# EAGLE schematic CFT-PB1-revF-TSSOP (EAGLE 5.11)
DRAWN_BY: Alexios; PROJECT_NAME: CFT Mini-Computer; REVISION: Rev K; SHEET_DESCRIPTION: Bus Connectors; SIMULATION_FILENAME: N/A; URL: http://www.bedroomlan.org/cft

## Sheet 1 of 9
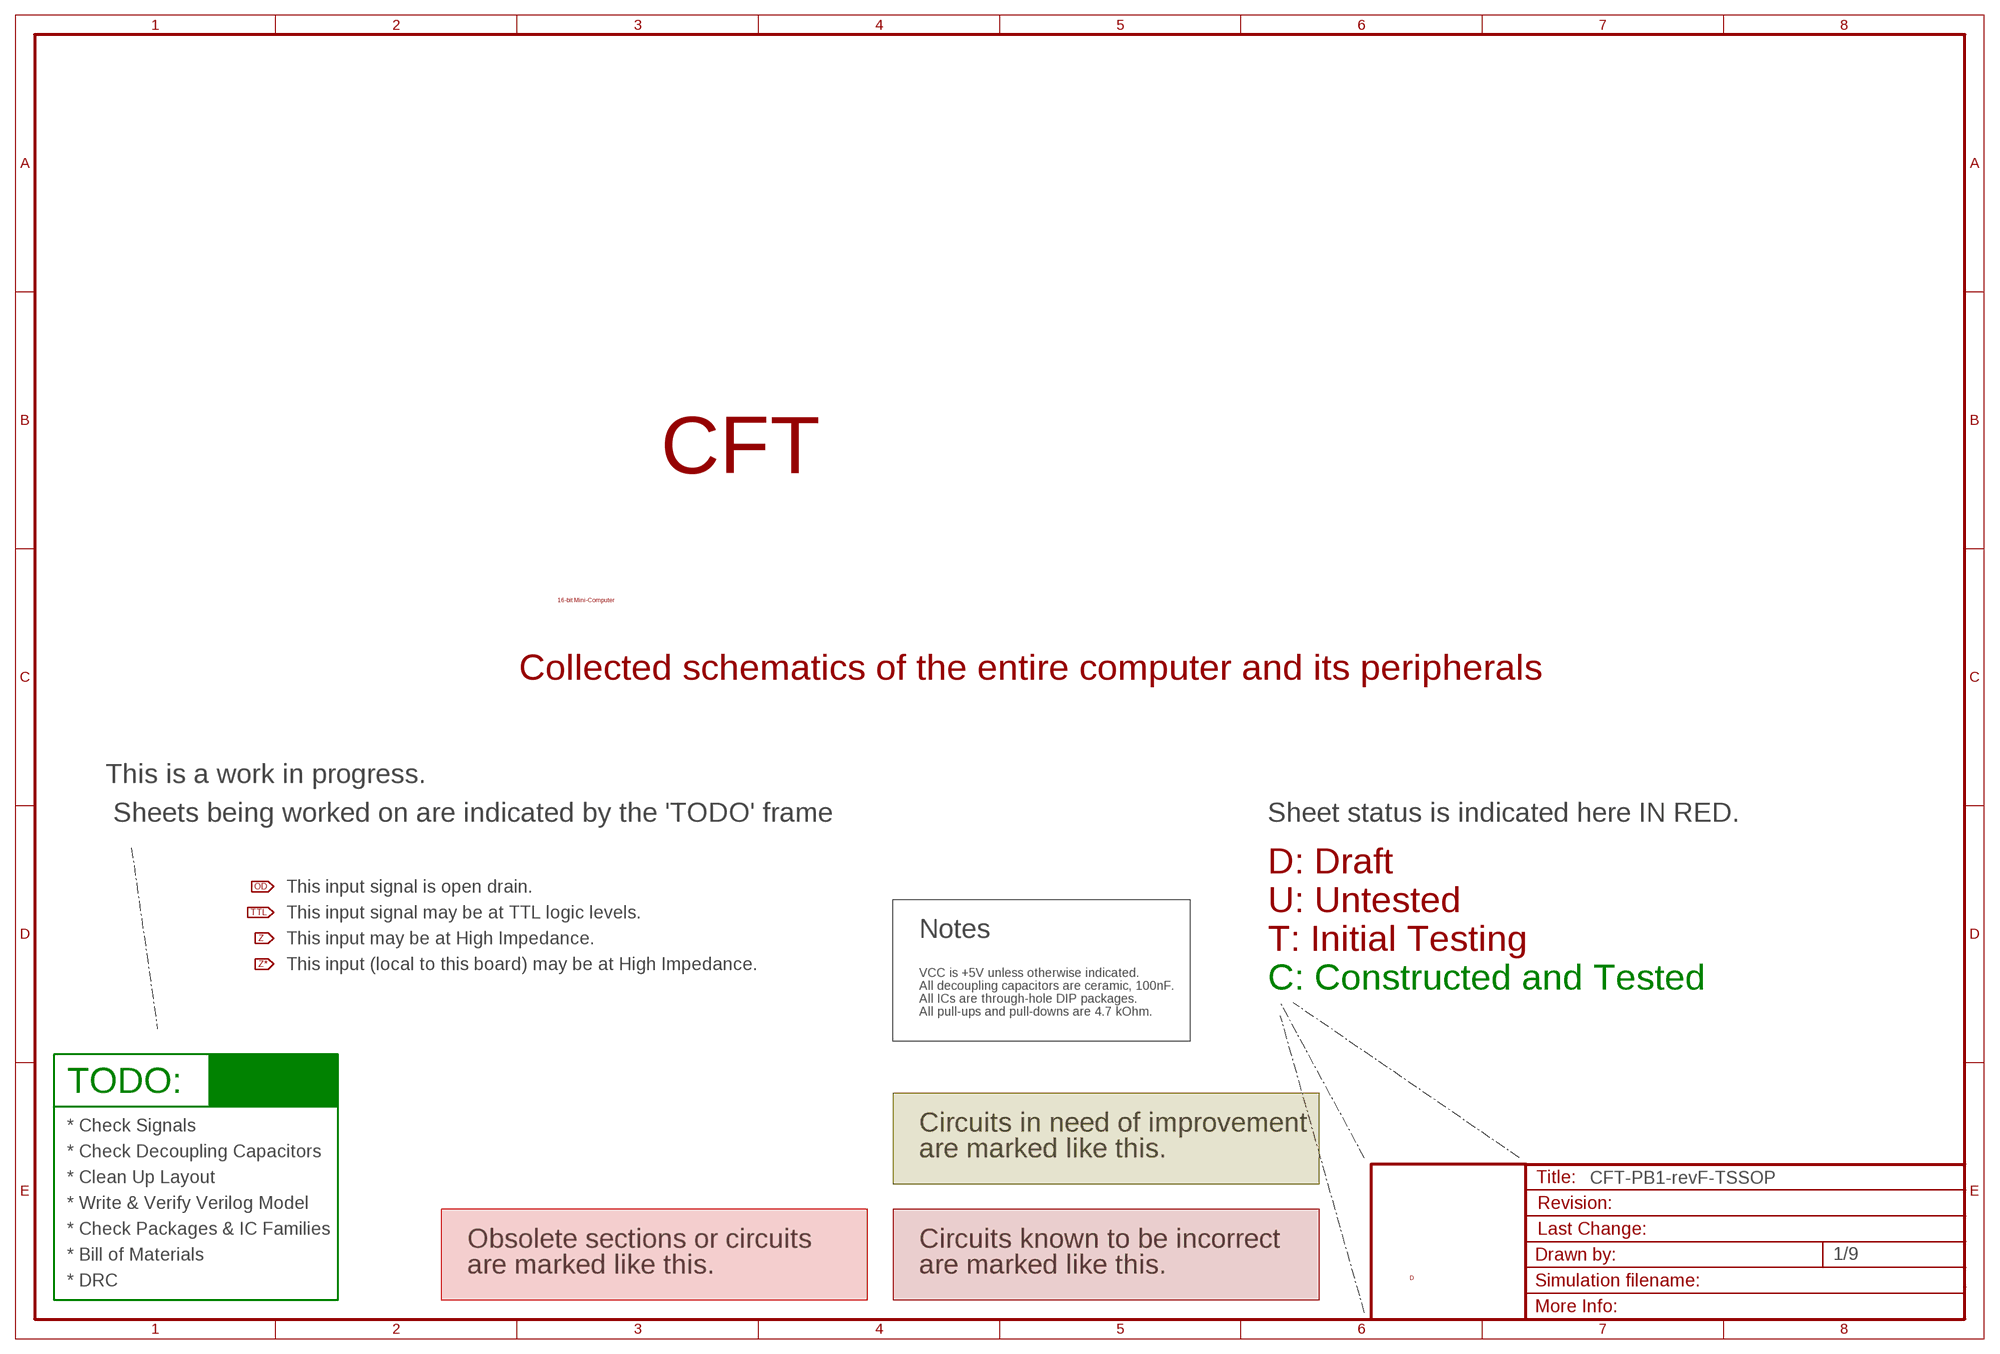
[diagram p0: schematic, sheet 1]

### Notes on the sheet
- CFT
- 16-bit Mini-Computer
- Collected schematics of the entire computer and its peripherals
- This is a work in progress.
- Sheets being worked on are indicated by the 'TODO' frame | Sheet status is indicated here IN RED.
- D: Draft
- This input signal is open drain.
- U: Untested
- This input signal may be at TTL logic levels.
- Notes
- This input may be at High Impedance.
- T: Initial Testing
- This input (local to this board) may be at High Impedance.
- VCC is +5V unless otherwise indicated.
- All decoupling capacitors are ceramic, 100nF. | C: Constructed and Tested
- All ICs are through-hole DIP packages.
- All pull-ups and pull-downs are 4.7 kOhm.
- TODO:
- * Check Signals | Circuits in need of improvement
- * Check Decoupling Capacitors | are marked like this.
- * Clean Up Layout
- * Write & Verify Verilog Model
- * Check Packages & IC Families
- Obsolete sections or circuits | Circuits known to be incorrect
- * Bill of Materials
- are marked like this. | are marked like this.
- D
- * DRC

## Sheet 2 of 9
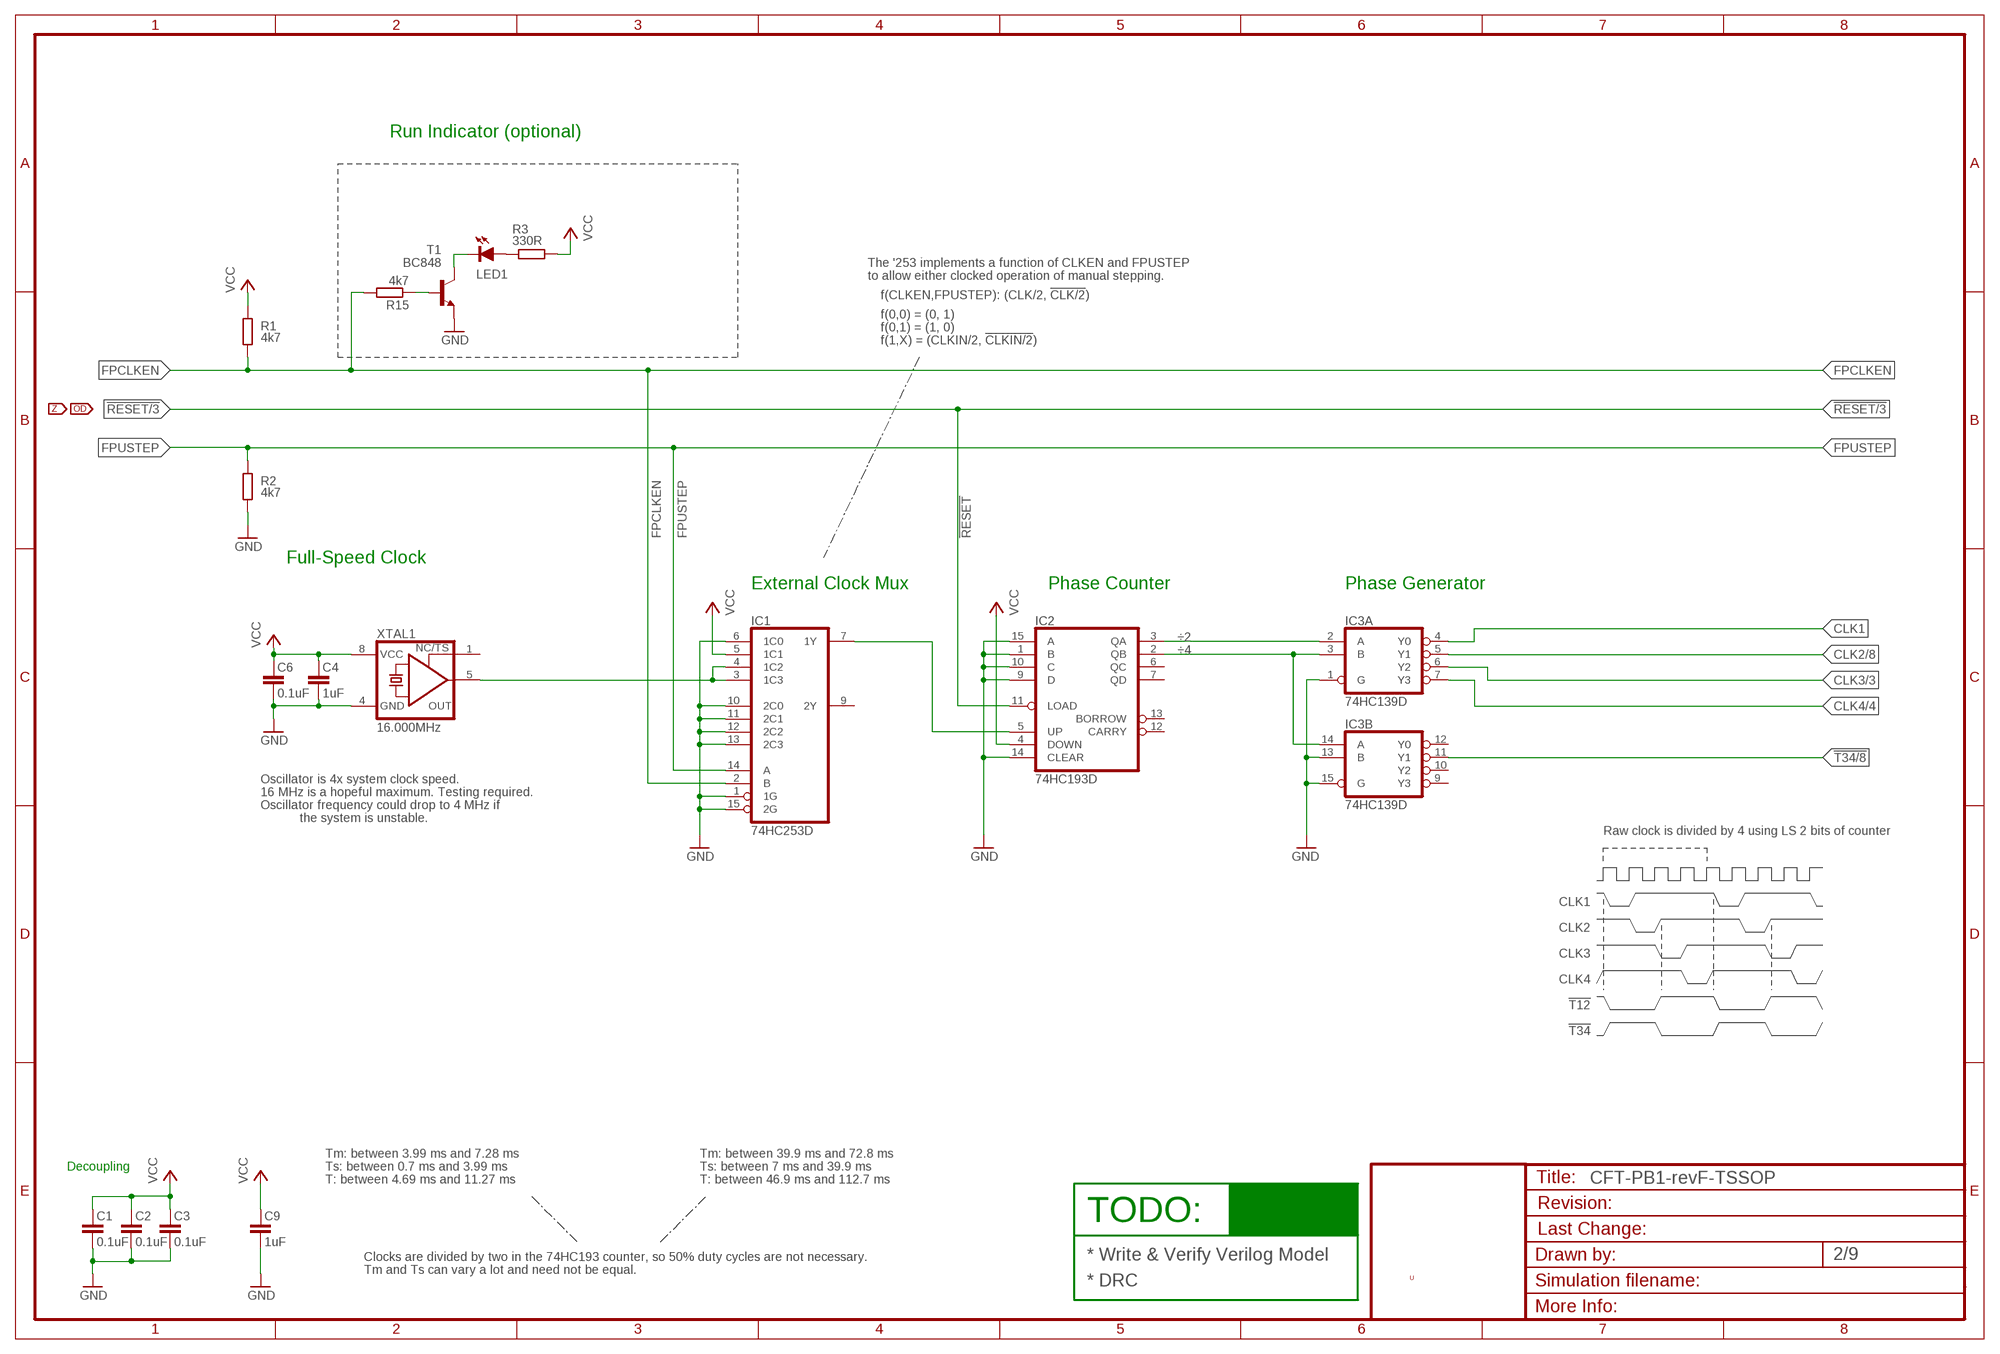
[diagram p1: schematic, sheet 2]

### Parts
C1  0.1uF  C-EUC0805K  [C0805K]
C2  0.1uF  C-EUC0805K  [C0805K]
C3  0.1uF  C-EUC0805K  [C0805K]
C4  1uF  C-EUC0805K  [C0805K]
C6  0.1uF  C-EUC0805K  [C0805K]
C9  1uF  C-EUC0805K  [C0805K]
IC1  74HC253D  [SO16]
IC2  74HC193D  [SO16D]
IC3  74HC139D  [SO16]
LED1  LED-5MM-GREEN  LEDCHIPLED_0805  [CHIPLED_0805]
R1  4k7  R-EU_R0805  [R0805]
R2  4k7  R-EU_R0805  [R0805]
R3  330R  R-EU_R0805  [R0805]
R15  4k7  R-EU_R0805  [R0805]
T1  BC848  [SOT23]
XTAL1  16.000MHz  XO-08-SOCKET  [DIL08S-SOCKET]

### Nets
!RESET: IC2.11(LOAD) ; also sheet 3,4,7,8,9
!T34: IC3.11(B:Y1) ; also sheet 8,9
CLK1: IC3.4(A:Y0) ; also sheet 9
CLK2: IC3.5(A:Y1) ; also sheet 8,9
CLK3: IC3.6(A:Y2) ; also sheet 3,9
CLK4: IC3.7(A:Y3) ; also sheet 4,8,9
CLKIN: IC1.7(1Y) IC2.5(UP)
FASTCLK: IC1.3(1C3) IC1.4(1C2) XTAL1.5(OUT)
FPCLKEN: IC1.2(B) R1.1 R15.2 ; also sheet 9
FPUSTEP: IC1.14(A) R2.2 ; also sheet 9
GND [Power rails]: C1.1 C2.1 C3.1 C4.1 C6.1 C9.1 IC1.1(1G) IC1.6(1C0) IC1.10(2C0) IC1.11(2C1) IC1.12(2C2) IC1.13(2C3) IC1.15(2G) IC2.1(B) IC2.9(D) IC2.10(C) IC2.14(CLEAR) IC2.15(A) IC3.1(A:G) IC3.13(B:B) IC3.15(B:G) R2.1 T1.2(E) XTAL1.4(GND) ; also sheet 3,4,5,6,7,8,9
N$8: R15.1 T1.1(B)
N$9: LED1.C T1.3(C)
N$10: LED1.A R3.2
VCC [Power rails]: C1.2 C2.2 C3.2 C4.2 C6.2 C9.2 IC1.5(1C1) IC2.4(DOWN) R1.2 R3.1 XTAL1.8(VCC) ; also sheet 3,4,5,6,7,8,9
÷2: IC2.3(QA) IC3.2(A:A)
÷4: IC2.2(QB) IC3.3(A:B) IC3.14(B:A)
Unconnected: IC1.9(2Y) IC2.6(QC) IC2.7(QD) IC2.12(CARRY) IC2.13(BORROW) IC3.9(B:Y3) IC3.10(B:Y2) IC3.12(B:Y0) XTAL1.1(TS)

### Notes on the sheet
- Run Indicator (optional)
- The '253 implements a function of CLKEN and FPUSTEP
- to allow either clocked operation of manual stepping.
- f(CLKEN,FPUSTEP): (CLK/2, !CLK/2!)
- f(0,0) = (0, 1)
- f(0,1) = (1, 0)
- f(1,X) = (CLKIN/2, !CLKIN/2!)
- Full-Speed Clock
- External Clock Mux | Phase Counter | Phase Generator
- Oscillator is 4x system clock speed.
- 16 MHz is a hopeful maximum. Testing required.
- Oscillator frequency could drop to 4 MHz if
- the system is unstable.
- Raw clock is divided by 4 using LS 2 bits of counter
- CLK1
- CLK2
- CLK3
- CLK4
- !T12
- !T34
- Tm: between 3.99 ms and 7.28 ms | Tm: between 39.9 ms and 72.8 ms
- Decoupling | Ts: between 0.7 ms and 3.99 ms | Ts: between 7 ms and 39.9 ms
- T: between 4.69 ms and 11.27 ms | T: between 46.9 ms and 112.7 ms
- TODO:
- Clocks are divided by two in the 74HC193 counter, so 50% duty cycles are not necessary. | * Write & Verify Verilog Model
- Tm and Ts can vary a lot and need not be equal.
- U
- * DRC

## Sheet 3 of 9
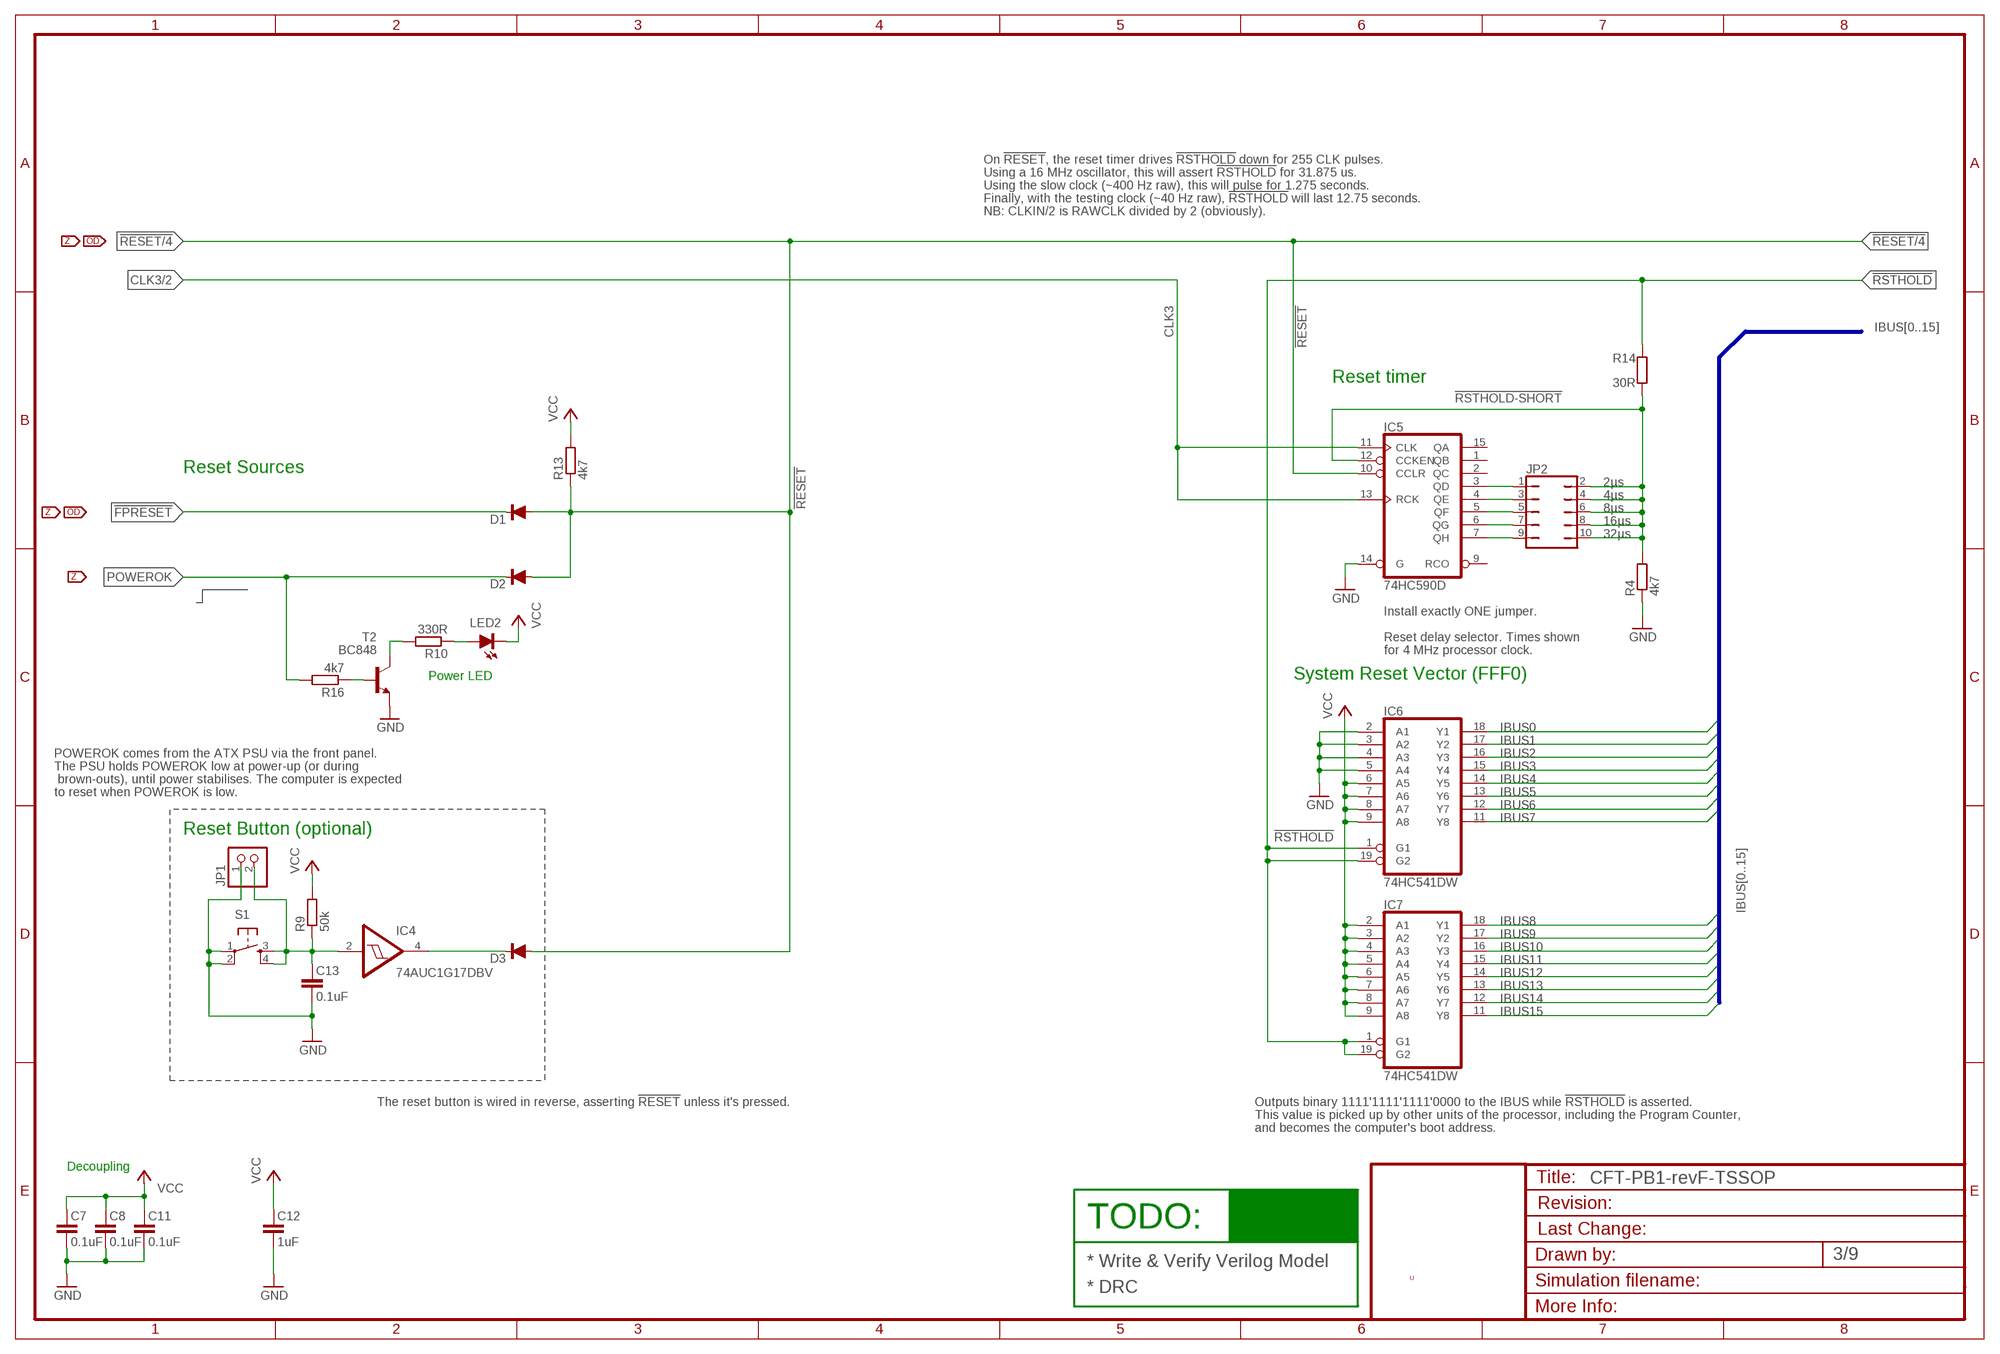
[diagram p2: schematic, sheet 3]

### Parts
C7  0.1uF  C-EUC0805K  [C0805K]
C8  0.1uF  C-EUC0805K  [C0805K]
C11  0.1uF  C-EUC0805K  [C0805K]
C12  1uF  C-EUC0805K  [C0805K]
C13  0.1uF  C-EUC0805K  [C0805K]
D1  DIODE-SOD123  [SOD123]
D2  DIODE-SOD123  [SOD123]
D3  DIODE-SOD123  [SOD123]
IC4  74AUC1G17DBV  [SOT23-5]
IC5  74HC590D  [SO16]
IC6  74HC541DW  [SO20W]
IC7  74HC541DW  [SO20W]
JP1  PINHD-1X2  [1X02]
JP2  JP5Q  [JP5Q]
LED2  LED-5MM-GREEN  LEDCHIPLED_0805  [CHIPLED_0805]
R4  4k7  R-EU_R0805  [R0805]
R9  50k  R-EU_R0805  [R0805]
R10  330R  R-EU_R0805  [R0805]
R13  4k7  R-EU_R0805  [R0805]
R14  30R  R-EU_R0805  [R0805]
R16  4k7  R-EU_R0805  [R0805]
S1  TAC_SWITCHPTH  [TACTILE-PTH]
T2  BC848  [SOT23]

### Nets
!FPRESET: D1.C ; also sheet 9
!RESET: D1.A D2.A D3.A IC5.10(CCLR) R13.1 ; also sheet 2,4,7,8,9
!RSTHOLD: IC6.1(G1) IC6.19(G2) IC7.1(G1) IC7.19(G2) R14.1 ; also sheet 9
!RSTHOLD-SHORT: IC5.12(CCKEN) JP2.2 JP2.4 JP2.6 JP2.8 JP2.10 R4.2 R14.2
CLK3: IC5.11(CLK) IC5.13(RCK) ; also sheet 2,9
GND [Power rails]: C7.1 C8.1 C11.1 C12.1 C13.1 IC5.14(G) IC6.2(A1) IC6.3(A2) IC6.4(A3) IC6.5(A4) JP1.1 R4.1 S1.1 S1.2 T2.2(E) ; also sheet 2,4,5,6,7,8,9
IBUS0: IC6.18(Y1) ; also sheet 5,6,8,9
IBUS1: IC6.17(Y2) ; also sheet 5,6,8,9
IBUS2: IC6.16(Y3) ; also sheet 5,6,8,9
IBUS3: IC6.15(Y4) ; also sheet 5,6,8,9
IBUS4: IC6.14(Y5) ; also sheet 5,6,8,9
IBUS5: IC6.13(Y6) ; also sheet 5,6,8,9
IBUS6: IC6.12(Y7) ; also sheet 5,6,8,9
IBUS7: IC6.11(Y8) ; also sheet 5,6,8,9
IBUS8: IC7.18(Y1) ; also sheet 5,6,8,9
IBUS9: IC7.17(Y2) ; also sheet 5,6,8,9
IBUS10: IC7.16(Y3) ; also sheet 5,6,8,9
IBUS11: IC7.15(Y4) ; also sheet 5,6,8,9
IBUS12: IC7.14(Y5) ; also sheet 5,6,8,9
IBUS13: IC7.13(Y6) ; also sheet 5,6,8,9
IBUS14: IC7.12(Y7) ; also sheet 5,6,8,9
IBUS15: IC7.11(Y8) ; also sheet 5,6,8,9
N$2: D3.C IC4.4(O)
N$11: R16.1 T2.1(B)
N$12: R10.2 T2.3(C)
N$33: C13.2 IC4.2(I) JP1.2 R9.1 S1.3 S1.4
N$36: IC5.7(QH) JP2.9
N$154: IC5.6(QG) JP2.7
N$375: IC5.5(QF) JP2.5
N$376: IC5.4(QE) JP2.3
N$377: IC5.3(QD) JP2.1
POWERLED: LED2.A R10.1
POWEROK: D2.C R16.2 ; also sheet 9
VCC [Power rails]: C7.2 C8.2 C11.2 C12.2 IC6.6(A5) IC6.7(A6) IC6.8(A7) IC6.9(A8) IC7.2(A1) IC7.3(A2) IC7.4(A3) IC7.5(A4) IC7.6(A5) IC7.7(A6) IC7.8(A7) IC7.9(A8) LED2.C R9.2 R13.2 ; also sheet 2,4,5,6,7,8,9
Unconnected: IC5.1(QB) IC5.2(QC) IC5.9(RCO) IC5.15(QA)

### Buses
IBUS[0..15]

### Notes on the sheet
- On !RESET!, the reset timer drives !RSTHOLD! down for 255 CLK pulses.
- Using a 16 MHz oscillator, this will assert !RSTHOLD! for 31.875 us.
- Using the slow clock (~400 Hz raw), this will pulse for 1.275 seconds.
- Finally, with the testing clock (~40 Hz raw), !RSTHOLD! will last 12.75 seconds.
- NB: CLKIN/2 is RAWCLK divided by 2 (obviously).
- Reset timer
- Reset Sources
- 2µs
- 4µs
- 8µs
- 16µs
- 32µs
- Install exactly ONE jumper.
- Reset delay selector. Times shown
- for 4 MHz processor clock.
- Power LED | System Reset Vector (FFF0)
- POWEROK comes from the ATX PSU via the front panel.
- The PSU holds POWEROK low at power-up (or during
- brown-outs), until power stabilises. The computer is expected
- to reset when POWEROK is low.
- Reset Button (optional)
- The reset button is wired in reverse, asserting !RESET! unless it's pressed. | Outputs binary 1111'1111'1111'0000 to the IBUS while !RSTHOLD! is asserted.
- This value is picked up by other units of the processor, including the Program Counter,
- and becomes the computer's boot address.
- Decoupling
- TODO:
- * Write & Verify Verilog Model
- U
- * DRC

## Sheet 4 of 9
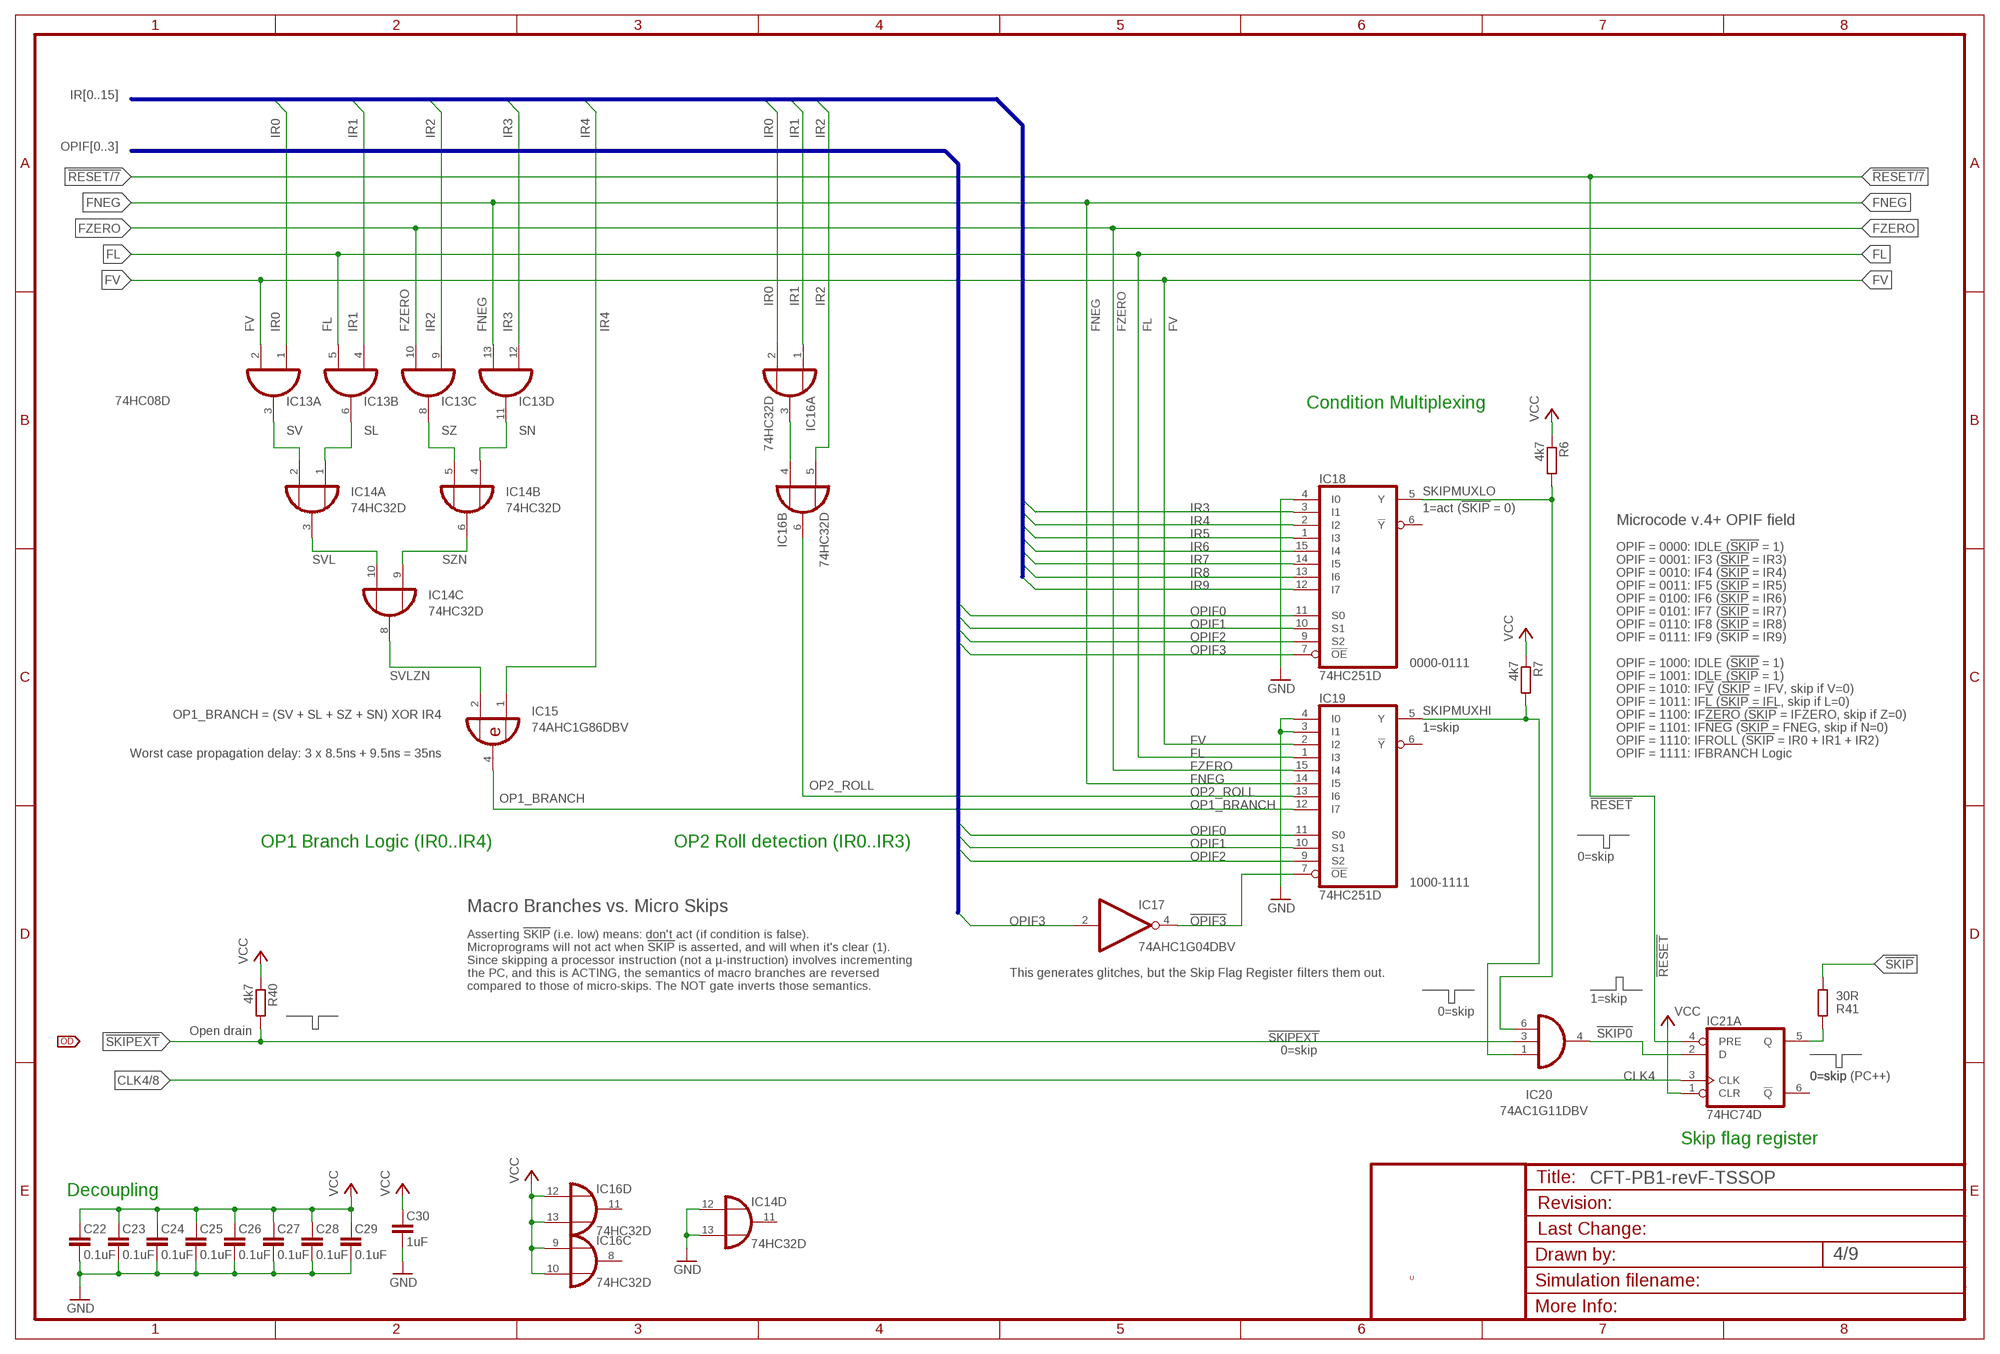
[diagram p3: schematic, sheet 4]

### Parts
C22  0.1uF  C-EUC0805K  [C0805K]
C23  0.1uF  C-EUC0805K  [C0805K]
C24  0.1uF  C-EUC0805K  [C0805K]
C25  0.1uF  C-EUC0805K  [C0805K]
C26  0.1uF  C-EUC0805K  [C0805K]
C27  0.1uF  C-EUC0805K  [C0805K]
C28  0.1uF  C-EUC0805K  [C0805K]
C29  0.1uF  C-EUC0805K  [C0805K]
C30  1uF  C-EUC0805K  [C0805K]
IC13  74HC08D  [SO14]
IC14  74HC32D  [SO14]
IC15  74AHC1G86DBV  [SOT23-5]
IC16  74HC32D  [SO14]
IC17  74AHC1G04DBV  [SOT23-5]
IC18  74HC251D  [SO16]
IC19  74HC251D  [SO16]
IC20  74AC1G11DBV  [DBV_R-PDSO-G6]
IC21  74HC74D  [SO14]
R6  4k7  R-EU_R0805  [R0805]
R7  4k7  R-EU_R0805  [R0805]
R40  4k7  R-EU_R0805  [R0805]
R41  30R  R-EU_R0805  [R0805]

### Nets
!OPIF3: IC17.4(O) IC19.7(!OE)
!RESET: IC21.4(A:PRE) ; also sheet 2,3,7,8,9
!SKIP: R41.1 ; also sheet 9
!SKIP0: IC20.4(O) IC21.2(A:D)
!SKIPEXT: IC20.3(I1) R40.2 ; also sheet 9
CLK4: IC21.3(A:CLK) ; also sheet 2,8,9
FL: IC13.5(B:I1) IC19.1(I3) ; also sheet 9
FNEG: IC13.13(D:I1) IC19.14(I5) ; also sheet 9
FV: IC13.2(A:I1) IC19.2(I2) ; also sheet 9
FZERO: IC13.10(C:I1) IC19.15(I4) ; also sheet 9
GND [Power rails]: C22.1 C23.1 C24.1 C25.1 C26.1 C27.1 C28.1 C29.1 C30.1 IC14.12(D:I0) IC14.13(D:I1) IC18.4(I0) IC19.3(I1) IC19.4(I0) ; also sheet 2,3,5,6,7,8,9
IR0: IC13.1(A:I0) IC16.2(A:I1) ; also sheet 5,6,9
IR1: IC13.4(B:I0) IC16.1(A:I0) ; also sheet 5,6
IR2: IC13.9(C:I0) IC16.5(B:I1) ; also sheet 5,6,9
IR3: IC13.12(D:I0) IC18.3(I1) ; also sheet 5,6
IR4: IC15.1(I0) IC18.2(I2) ; also sheet 5,6
IR5: IC18.1(I3) ; also sheet 5,6
IR6: IC18.15(I4) ; also sheet 5,6
IR7: IC18.14(I5) ; also sheet 5,6
IR8: IC18.13(I6) ; also sheet 5,6
IR9: IC18.12(I7) ; also sheet 5,6
N$23: IC16.3(A:O) IC16.4(B:I0)
N$35: IC21.5(A:Q) R41.2
OP1_BRANCH: IC15.4(O) IC19.12(I7)
OP2_ROLL: IC16.6(B:O) IC19.13(I6)
OPIF0: IC18.11(S0) IC19.11(S0) ; also sheet 9
OPIF1: IC18.10(S1) IC19.10(S1) ; also sheet 9
OPIF2: IC18.9(S2) IC19.9(S2) ; also sheet 9
OPIF3: IC17.2(I) IC18.7(!OE) ; also sheet 9
SKIPMUXHI: IC19.5(Y) IC20.1(I0) R7.2
SKIPMUXLO: IC18.5(Y) IC20.6(I2) R6.2
SL: IC13.6(B:O) IC14.1(A:I0)
SN: IC13.11(D:O) IC14.4(B:I0)
SV: IC13.3(A:O) IC14.2(A:I1)
SVL: IC14.3(A:O) IC14.10(C:I1)
SVLZN: IC14.8(C:O) IC15.2(I1)
SZ: IC13.8(C:O) IC14.5(B:I1)
SZN: IC14.6(B:O) IC14.9(C:I0)
VCC [Power rails]: C22.2 C23.2 C24.2 C25.2 C26.2 C27.2 C28.2 C29.2 C30.2 IC16.9(C:I0) IC16.10(C:I1) IC16.12(D:I0) IC16.13(D:I1) IC21.1(A:CLR) R6.1 R7.1 R40.1 ; also sheet 2,3,5,6,7,8,9
Unconnected: IC14.11(D:O) IC16.8(C:O) IC16.11(D:O) IC18.6(!Y) IC19.6(!Y) IC21.6(A:!Q)

### Buses
IR[0..15]
OPIF[0..3]

### Notes on the sheet
- Condition Multiplexing
- 1=act (!SKIP! = 0)
- Microcode v.4+ OPIF field
- OPIF = 0000: IDLE (!SKIP! = 1)
- OPIF = 0001: IF3 (!SKIP! = IR3)
- OPIF = 0010: IF4 (!SKIP! = IR4)
- OPIF = 0011: IF5 (!SKIP! = IR5)
- OPIF = 0100: IF6 (!SKIP! = IR6)
- OPIF = 0101: IF7 (!SKIP! = IR7)
- OPIF = 0110: IF8 (!SKIP! = IR8)
- OPIF = 0111: IF9 (!SKIP! = IR9)
- 0000-0111 | OPIF = 1000: IDLE (!SKIP! = 1)
- OPIF = 1001: IDLE (!SKIP! = 1)
- OPIF = 1010: IF!V! (!SKIP! = IFV, skip if V=0)
- OPIF = 1011: IF!L! (!SKIP! = IFL, skip if L=0)
- OP1_BRANCH = (SV + SL + SZ + SN) XOR IR4 | OPIF = 1100: IF!ZERO! (!SKIP! = IFZERO, skip if Z=0)
- 1=skip | OPIF = 1101: IF!NEG! (!SKIP! = FNEG, skip if N=0)
- OPIF = 1110: IFROLL (!SKIP! = IR0 + IR1 + IR2)
- Worst case propagation delay: 3 x 8.5ns + 9.5ns = 35ns | OPIF = 1111: IFBRANCH Logic
- OP1 Branch Logic (IR0..IR4) | OP2 Roll detection (IR0..IR3)
- 0=skip
- 1000-1111
- Macro Branches vs. Micro Skips
- Asserting !SKIP! (i.e. low) means: don't act (if condition is false).
- Microprograms will not act when !SKIP! is asserted, and will when it's clear (1).
- Since skipping a processor instruction (not a µ-instruction) involves incrementing
- the PC, and this is ACTING, the semantics of macro branches are reversed | This generates glitches, but the Skip Flag Register filters them out.
- compared to those of micro-skips. The NOT gate inverts those semantics.
- 1=skip
- 0=skip
- Open drain
- 0=skip
- 0=skip | 0=skip (PC++)
- Skip flag register
- Decoupling
- U

## Sheet 5 of 9
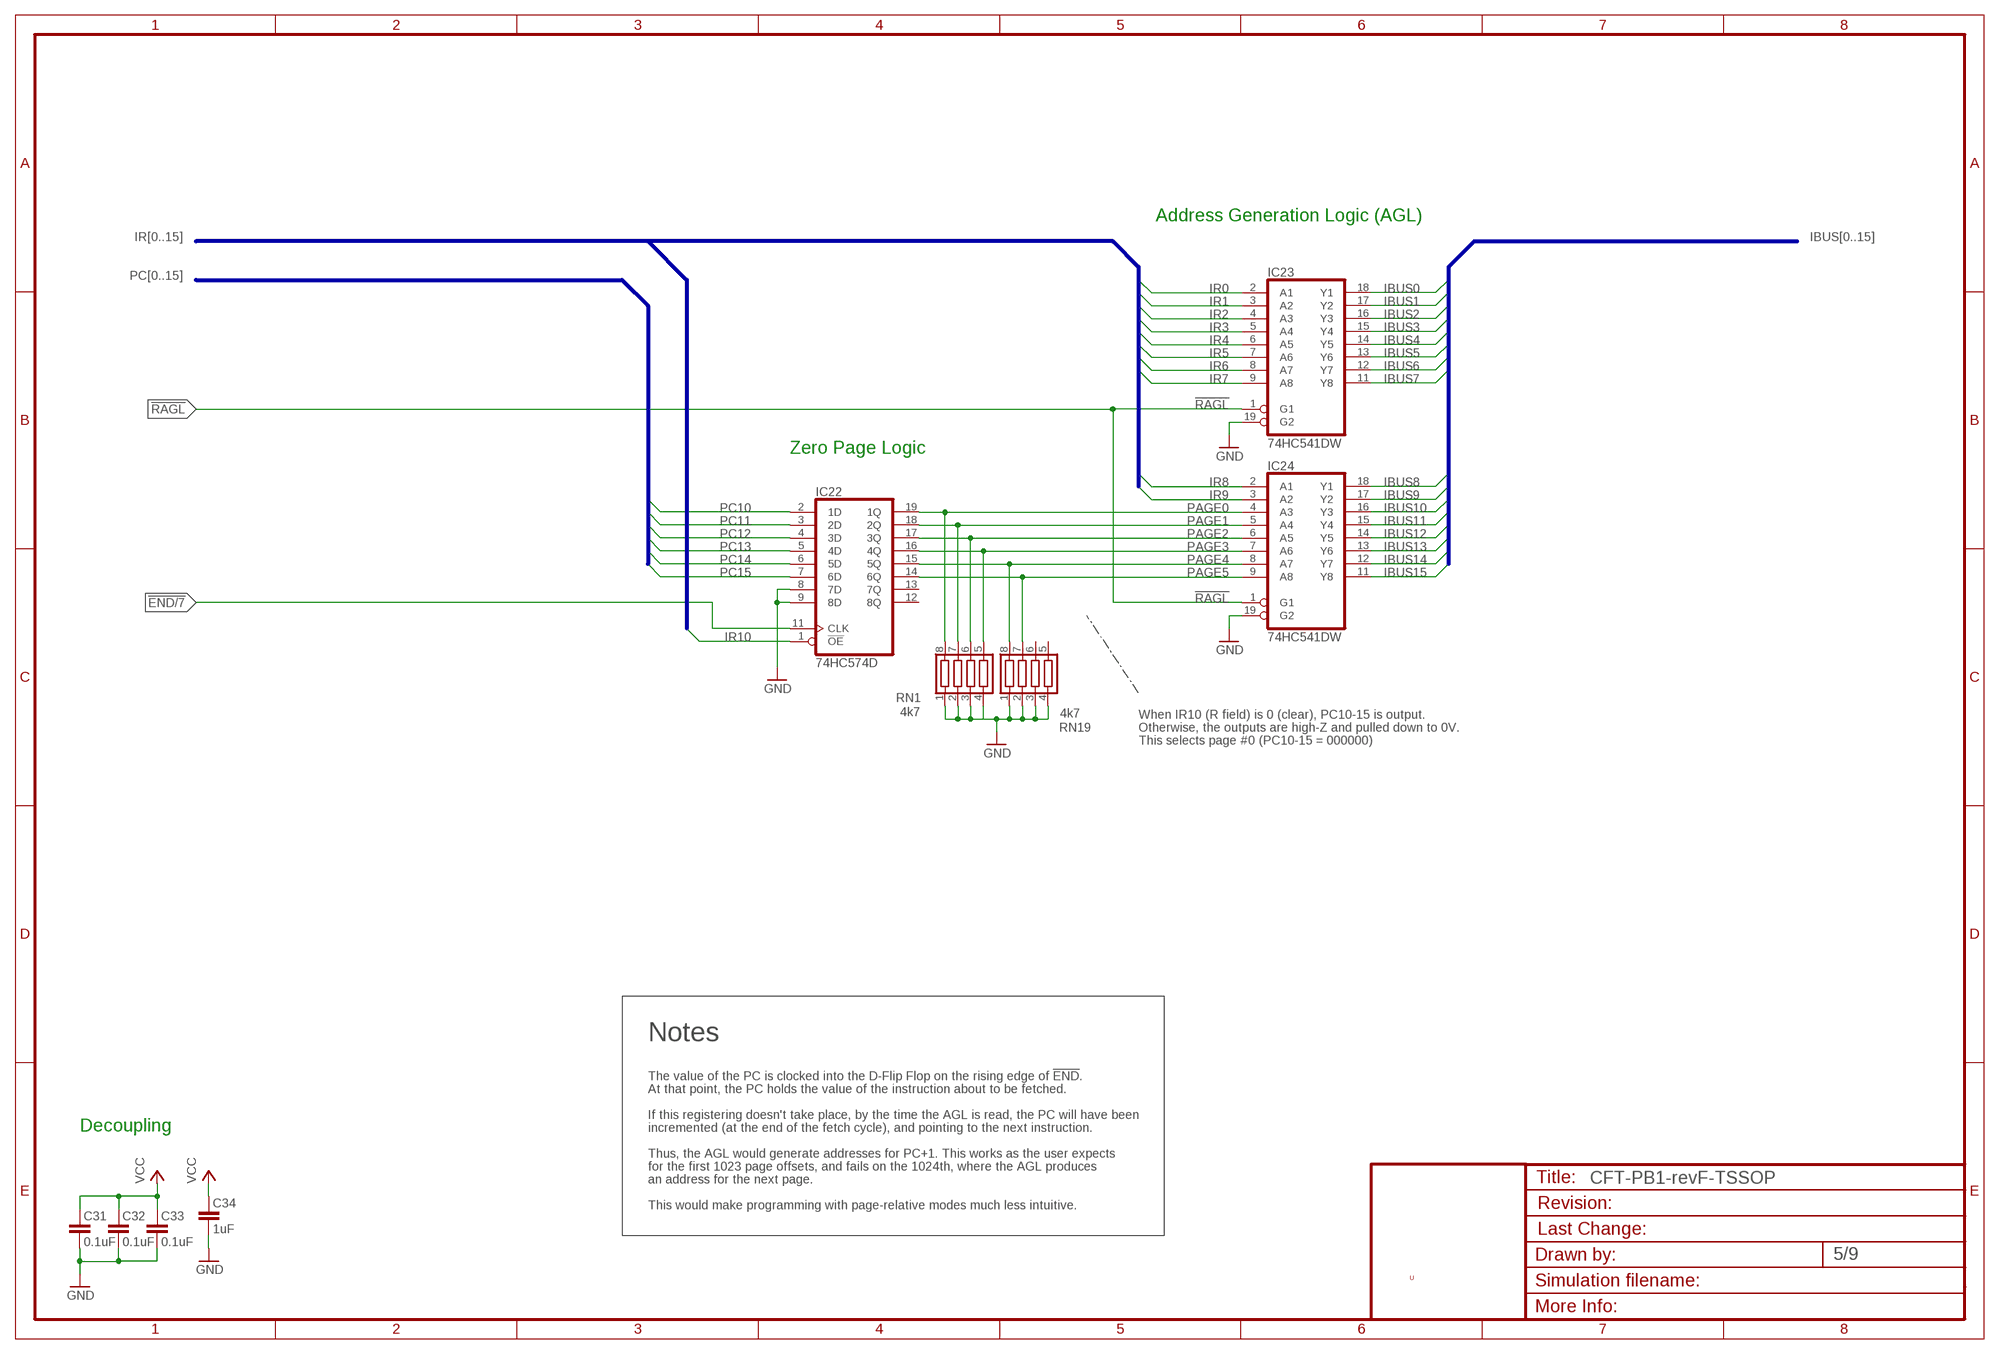
[diagram p4: schematic, sheet 5]

### Parts
C31  0.1uF  C-EUC0805K  [C0805K]
C32  0.1uF  C-EUC0805K  [C0805K]
C33  0.1uF  C-EUC0805K  [C0805K]
C34  1uF  C-EUC0805K  [C0805K]
IC22  74HC574D  [SO20W]
IC23  74HC541DW  [SO20W]
IC24  74HC541DW  [SO20W]
RN1  4k7  CTS742C083  [CTS742C083]
RN19  4k7  CTS742C083  [CTS742C083]

### Nets
!END: IC22.11(CLK) ; also sheet 7,9
!RAGL: IC23.1(G1) IC24.1(G1) ; also sheet 9
GND [Power rails]: C31.1 C32.1 C33.1 C34.1 IC22.8(7D) IC22.9(8D) IC23.19(G2) IC24.19(G2) RN1.1 RN1.2 RN1.3 RN1.4 RN19.1 RN19.2 RN19.3 RN19.4 ; also sheet 2,3,4,6,7,8,9
IBUS0: IC23.18(Y1) ; also sheet 3,6,8,9
IBUS1: IC23.17(Y2) ; also sheet 3,6,8,9
IBUS2: IC23.16(Y3) ; also sheet 3,6,8,9
IBUS3: IC23.15(Y4) ; also sheet 3,6,8,9
IBUS4: IC23.14(Y5) ; also sheet 3,6,8,9
IBUS5: IC23.13(Y6) ; also sheet 3,6,8,9
IBUS6: IC23.12(Y7) ; also sheet 3,6,8,9
IBUS7: IC23.11(Y8) ; also sheet 3,6,8,9
IBUS8: IC24.18(Y1) ; also sheet 3,6,8,9
IBUS9: IC24.17(Y2) ; also sheet 3,6,8,9
IBUS10: IC24.16(Y3) ; also sheet 3,6,8,9
IBUS11: IC24.15(Y4) ; also sheet 3,6,8,9
IBUS12: IC24.14(Y5) ; also sheet 3,6,8,9
IBUS13: IC24.13(Y6) ; also sheet 3,6,8,9
IBUS14: IC24.12(Y7) ; also sheet 3,6,8,9
IBUS15: IC24.11(Y8) ; also sheet 3,6,8,9
IR0: IC23.2(A1) ; also sheet 4,6,9
IR1: IC23.3(A2) ; also sheet 4,6
IR2: IC23.4(A3) ; also sheet 4,6,9
IR3: IC23.5(A4) ; also sheet 4,6
IR4: IC23.6(A5) ; also sheet 4,6
IR5: IC23.7(A6) ; also sheet 4,6
IR6: IC23.8(A7) ; also sheet 4,6
IR7: IC23.9(A8) ; also sheet 4,6
IR8: IC24.2(A1) ; also sheet 4,6
IR9: IC24.3(A2) ; also sheet 4,6
IR10: IC22.1(!OE) ; also sheet 6
PAGE0: IC22.19(1Q) IC24.4(A3) RN1.8
PAGE1: IC22.18(2Q) IC24.5(A4) RN1.7
PAGE2: IC22.17(3Q) IC24.6(A5) RN1.6
PAGE3: IC22.16(4Q) IC24.7(A6) RN1.5
PAGE4: IC22.15(5Q) IC24.8(A7) RN19.8
PAGE5: IC22.14(6Q) IC24.9(A8) RN19.7
PC10: IC22.2(1D) ; also sheet 9
PC11: IC22.3(2D) ; also sheet 9
PC12: IC22.4(3D) ; also sheet 9
PC13: IC22.5(4D) ; also sheet 9
PC14: IC22.6(5D) ; also sheet 9
PC15: IC22.7(6D) ; also sheet 9
VCC [Power rails]: C31.2 C32.2 C33.2 C34.2 ; also sheet 2,3,4,6,7,8,9
Unconnected: IC22.12(8Q) IC22.13(7Q) RN19.5 RN19.6

### Buses
IBUS[0..15]
IR[0..15]
PC[0..15]

### Notes on the sheet
- Address Generation Logic (AGL)
- Zero Page Logic
- When IR10 (R field) is 0 (clear), PC10-15 is output.
- Otherwise, the outputs are high-Z and pulled down to 0V.
- This selects page #0 (PC10-15 = 000000)
- Notes
- The value of the PC is clocked into the D-Flip Flop on the rising edge of !END!.
- At that point, the PC holds the value of the instruction about to be fetched.
- If this registering doesn't take place, by the time the AGL is read, the PC will have been
- Decoupling | incremented (at the end of the fetch cycle), and pointing to the next instruction.
- Thus, the AGL would generate addresses for PC+1. This works as the user expects
- for the first 1023 page offsets, and fails on the 1024th, where the AGL produces
- an address for the next page.
- This would make programming with page-relative modes much less intuitive.
- U

## Sheet 6 of 9
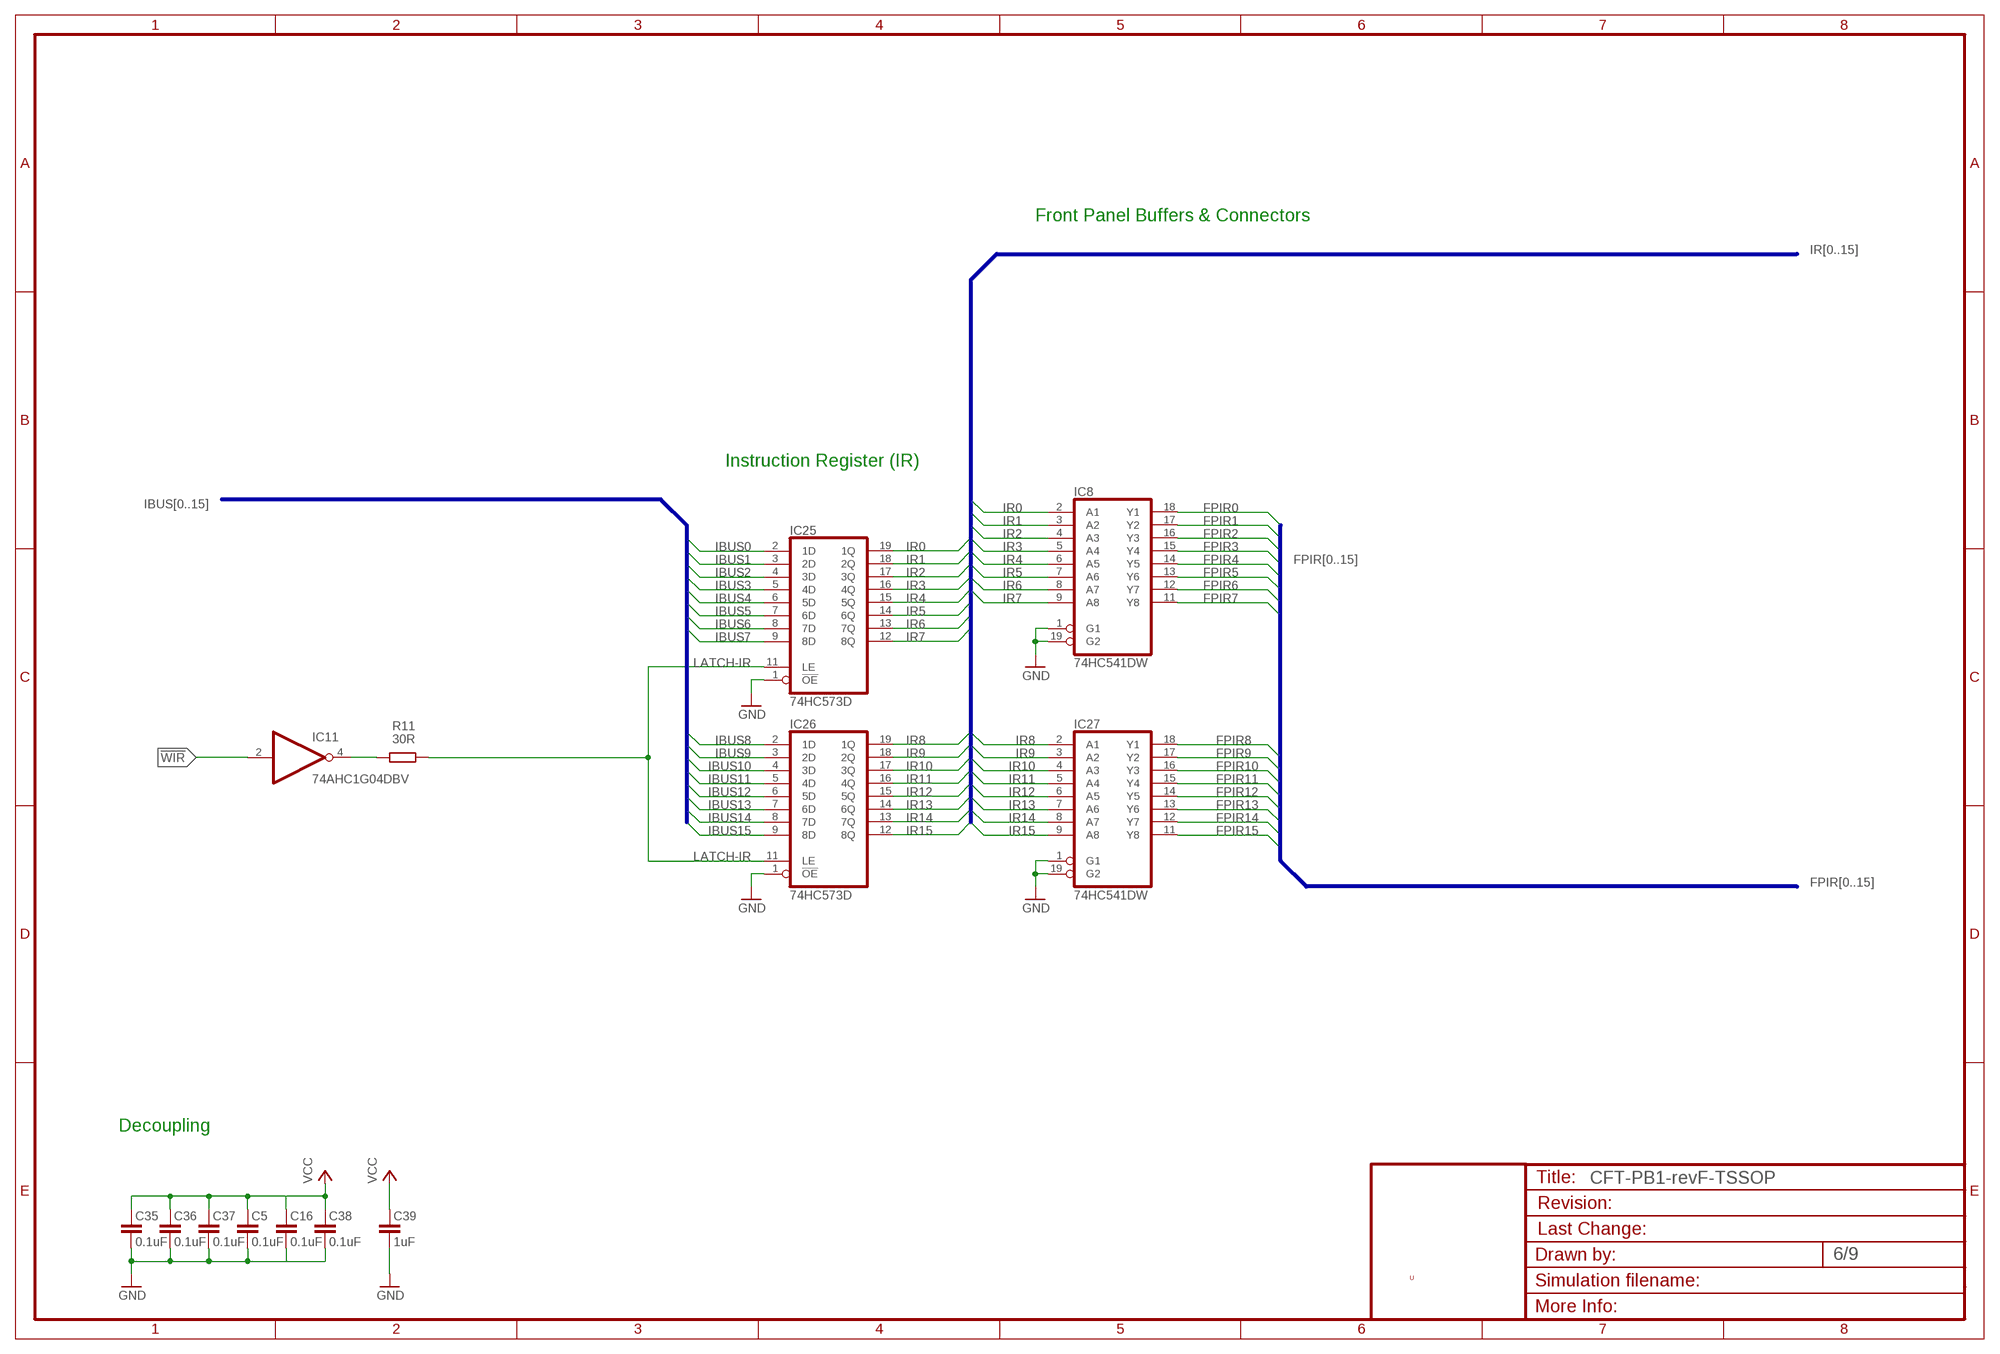
[diagram p5: schematic, sheet 6]

### Parts
C5  0.1uF  C-EUC0805K  [C0805K]
C16  0.1uF  C-EUC0805K  [C0805K]
C35  0.1uF  C-EUC0805K  [C0805K]
C36  0.1uF  C-EUC0805K  [C0805K]
C37  0.1uF  C-EUC0805K  [C0805K]
C38  0.1uF  C-EUC0805K  [C0805K]
C39  1uF  C-EUC0805K  [C0805K]
IC8  74HC541DW  [SO20W]
IC11  74AHC1G04DBV  [SOT23-5]
IC25  74HC573D  [SO20W]
IC26  74HC573D  [SO20W]
IC27  74HC541DW  [SO20W]
R11  30R  R-EU_R0805  [R0805]

### Nets
!WIR: IC11.2(I) ; also sheet 9
FPIR0: IC8.18(Y1) ; also sheet 9
FPIR1: IC8.17(Y2) ; also sheet 9
FPIR2: IC8.16(Y3) ; also sheet 9
FPIR3: IC8.15(Y4) ; also sheet 9
FPIR4: IC8.14(Y5) ; also sheet 9
FPIR5: IC8.13(Y6) ; also sheet 9
FPIR6: IC8.12(Y7) ; also sheet 9
FPIR7: IC8.11(Y8) ; also sheet 9
FPIR8: IC27.18(Y1) ; also sheet 9
FPIR9: IC27.17(Y2) ; also sheet 9
FPIR10: IC27.16(Y3) ; also sheet 9
FPIR11: IC27.15(Y4) ; also sheet 9
FPIR12: IC27.14(Y5) ; also sheet 9
FPIR13: IC27.13(Y6) ; also sheet 9
FPIR14: IC27.12(Y7) ; also sheet 9
FPIR15: IC27.11(Y8) ; also sheet 9
GND [Power rails]: C5.1 C16.1 C35.1 C36.1 C37.1 C38.1 C39.1 IC8.1(G1) IC8.19(G2) IC25.1(!OE) IC26.1(!OE) IC27.1(G1) IC27.19(G2) ; also sheet 2,3,4,5,7,8,9
IBUS0: IC25.2(1D) ; also sheet 3,5,8,9
IBUS1: IC25.3(2D) ; also sheet 3,5,8,9
IBUS2: IC25.4(3D) ; also sheet 3,5,8,9
IBUS3: IC25.5(4D) ; also sheet 3,5,8,9
IBUS4: IC25.6(5D) ; also sheet 3,5,8,9
IBUS5: IC25.7(6D) ; also sheet 3,5,8,9
IBUS6: IC25.8(7D) ; also sheet 3,5,8,9
IBUS7: IC25.9(8D) ; also sheet 3,5,8,9
IBUS8: IC26.2(1D) ; also sheet 3,5,8,9
IBUS9: IC26.3(2D) ; also sheet 3,5,8,9
IBUS10: IC26.4(3D) ; also sheet 3,5,8,9
IBUS11: IC26.5(4D) ; also sheet 3,5,8,9
IBUS12: IC26.6(5D) ; also sheet 3,5,8,9
IBUS13: IC26.7(6D) ; also sheet 3,5,8,9
IBUS14: IC26.8(7D) ; also sheet 3,5,8,9
IBUS15: IC26.9(8D) ; also sheet 3,5,8,9
IR0: IC8.2(A1) IC25.19(1Q) ; also sheet 4,5,9
IR1: IC8.3(A2) IC25.18(2Q) ; also sheet 4,5
IR2: IC8.4(A3) IC25.17(3Q) ; also sheet 4,5,9
IR3: IC8.5(A4) IC25.16(4Q) ; also sheet 4,5
IR4: IC8.6(A5) IC25.15(5Q) ; also sheet 4,5
IR5: IC8.7(A6) IC25.14(6Q) ; also sheet 4,5
IR6: IC8.8(A7) IC25.13(7Q) ; also sheet 4,5
IR7: IC8.9(A8) IC25.12(8Q) ; also sheet 4,5
IR8: IC26.19(1Q) IC27.2(A1) ; also sheet 4,5
IR9: IC26.18(2Q) IC27.3(A2) ; also sheet 4,5
IR10: IC26.17(3Q) IC27.4(A3) ; also sheet 5
IR11: IC26.16(4Q) IC27.5(A4) ; also sheet 9
IR12: IC26.15(5Q) IC27.6(A5) ; also sheet 9
IR13: IC26.14(6Q) IC27.7(A6) ; also sheet 9
IR14: IC26.13(7Q) IC27.8(A7) ; also sheet 9
IR15: IC26.12(8Q) IC27.9(A8) ; also sheet 9
LATCH-IR: IC25.11(LE) IC26.11(LE) R11.2
N$13: IC11.4(O) R11.1
VCC [Power rails]: C5.2 C16.2 C35.2 C36.2 C37.2 C38.2 C39.2 ; also sheet 2,3,4,5,7,8,9

### Buses
IBUS[0..15]
IR[0..15]
FPIR[0..15]

### Notes on the sheet
- Front Panel Buffers & Connectors
- Instruction Register (IR)
- Decoupling
- U

## Sheet 7 of 9
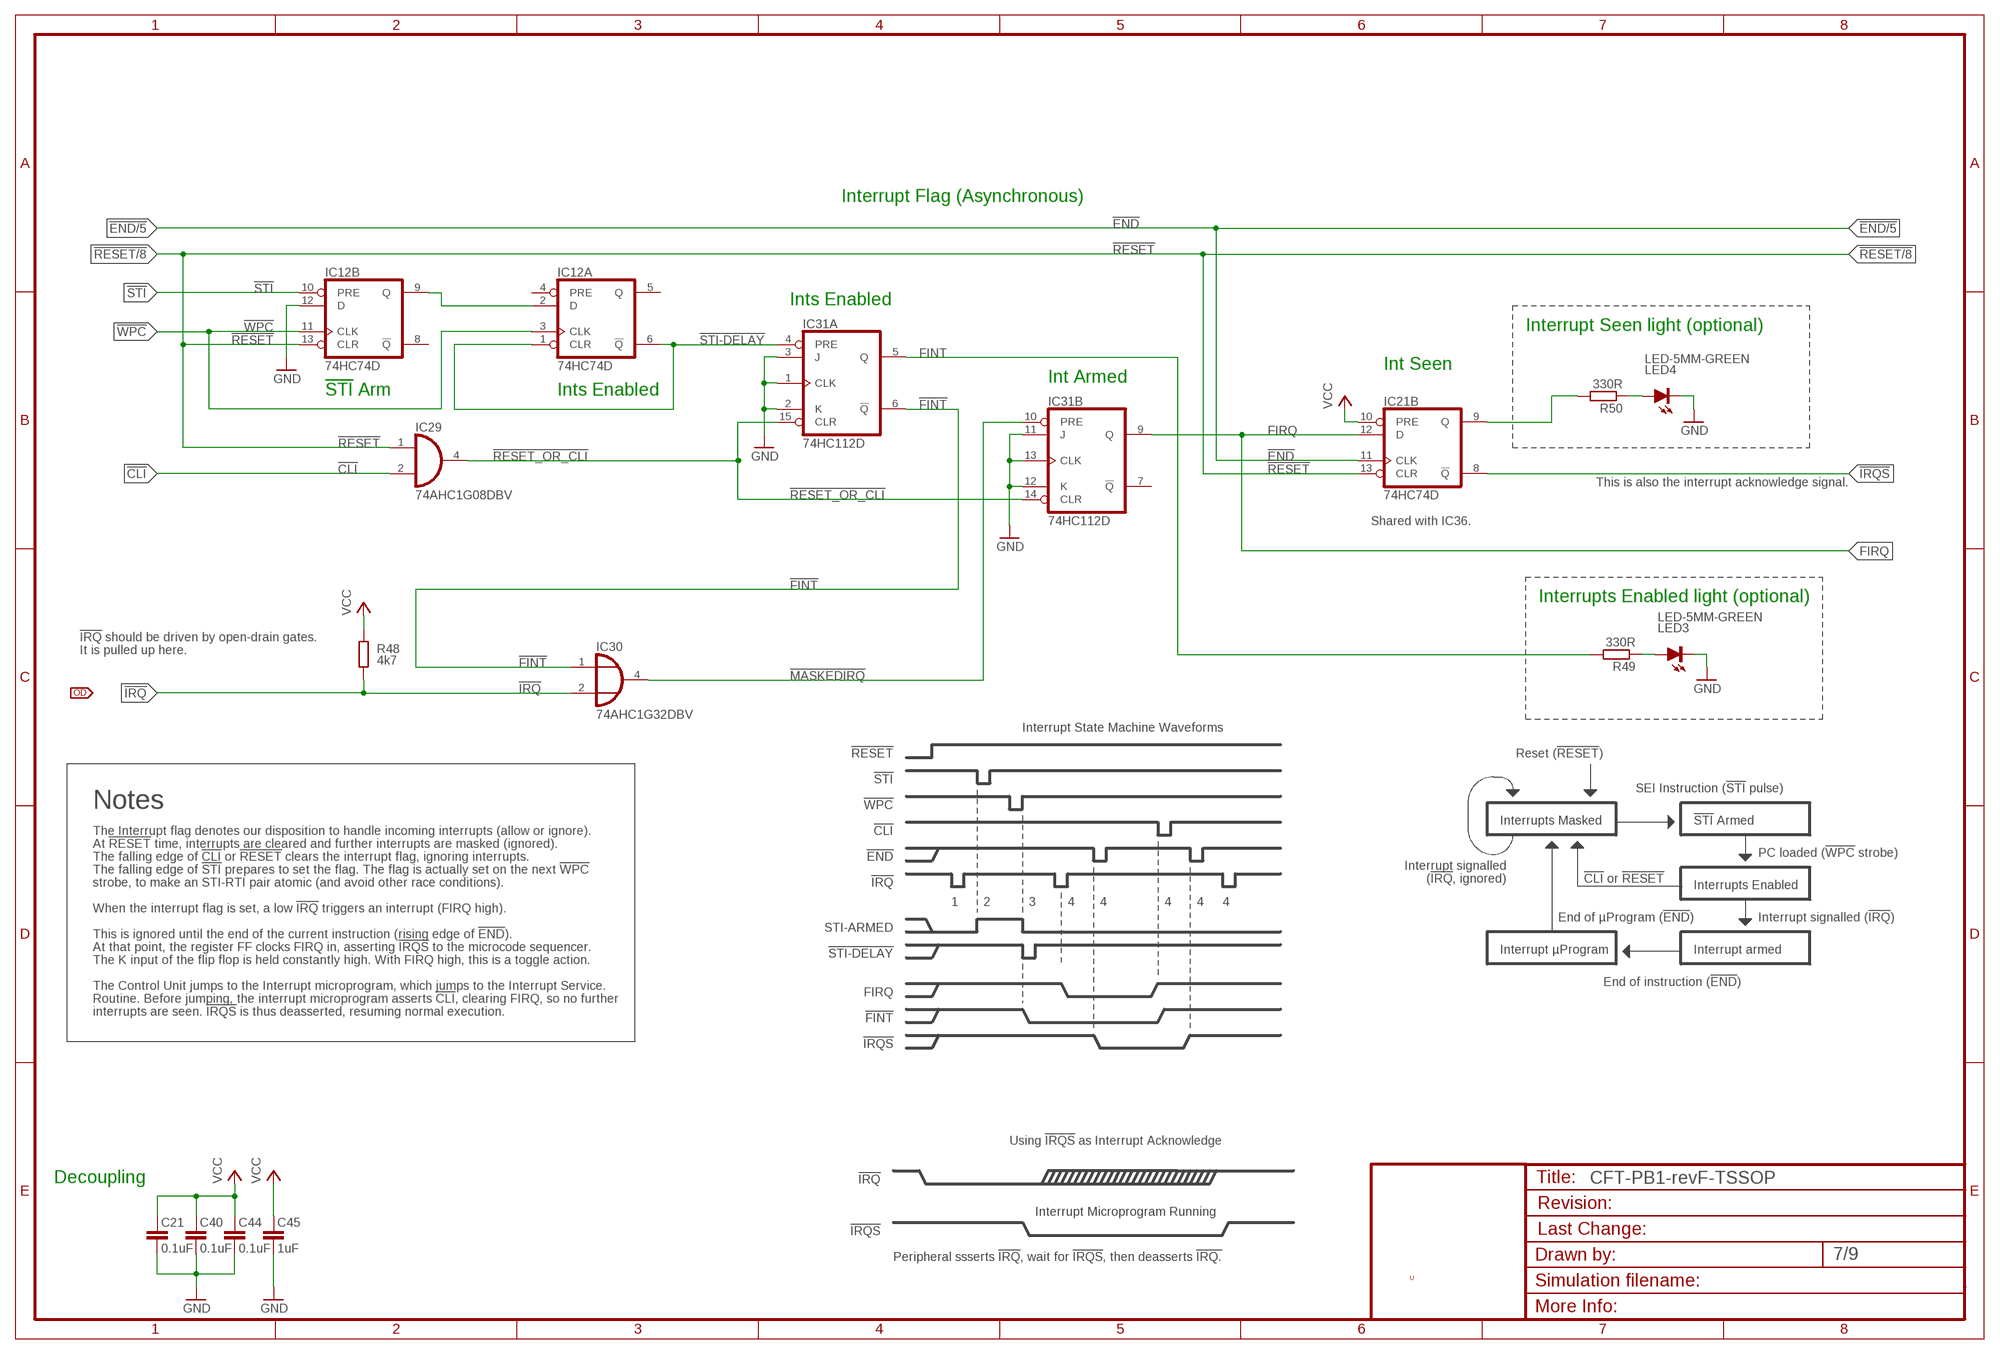
[diagram p6: schematic, sheet 7]

### Parts
C21  0.1uF  C-EUC0805K  [C0805K]
C40  0.1uF  C-EUC0805K  [C0805K]
C44  0.1uF  C-EUC0805K  [C0805K]
C45  1uF  C-EUC0805K  [C0805K]
IC12  74HC74D  [SO14]
IC29  74AHC1G08DBV  [SOT23-5]
IC30  74AHC1G32DBV  [SOT23-5]
IC31  74HC112D  [SO16]
LED3  LED-5MM-GREEN  LEDCHIPLED_0805  [CHIPLED_0805]
LED4  LED-5MM-GREEN  LEDCHIPLED_0805  [CHIPLED_0805]
R48  4k7  R-EU_R0805  [R0805]
R49  330R  R-EU_R0805  [R0805]
R50  330R  R-EU_R0805  [R0805]

### Nets
!CLI: IC29.2(I1) ; also sheet 9
!END: IC21.11(B:CLK) ; also sheet 5,9
!FINT: IC30.1(I0) IC31.6(A:!Q)
!IRQ: IC30.2(I1) R48.1 ; also sheet 9
!IRQS: IC21.8(B:!Q) ; also sheet 9
!MASKEDIRQ: IC30.4(O) IC31.10(B:PRE)
!RESET: IC12.13(B:CLR) IC21.13(B:CLR) IC29.1(I0) ; also sheet 2,3,4,8,9
!RESET_OR_CLI: IC29.4(O) IC31.14(B:CLR) IC31.15(A:CLR)
!STI: IC12.10(B:PRE) ; also sheet 9
!STI-DELAY: IC12.1(A:CLR) IC12.6(A:!Q) IC31.4(A:PRE)
!WPC: IC12.3(A:CLK) IC12.11(B:CLK) ; also sheet 9
FINT: IC31.5(A:Q) R49.2
FIRQ: IC21.12(B:D) IC31.9(B:Q) ; also sheet 9
GND [Power rails]: C21.1 C40.1 C44.1 C45.1 IC12.12(B:D) IC31.1(A:CLK) IC31.2(A:K) IC31.3(A:J) IC31.11(B:J) IC31.12(B:K) IC31.13(B:CLK) LED3.C LED4.C ; also sheet 2,3,4,5,6,8,9
N$28: IC12.2(A:D) IC12.9(B:Q)
N$732: LED4.A R50.1
N$733: LED3.A R49.1
N$739: IC21.9(B:Q) R50.2
VCC [Power rails]: C21.2 C40.2 C44.2 C45.2 IC21.10(B:PRE) R48.2 ; also sheet 2,3,4,5,6,8,9
Unconnected: IC12.4(A:PRE) IC12.5(A:Q) IC12.8(B:!Q) IC31.7(B:!Q)

### Notes on the sheet
- Interrupt Flag (Asynchronous)
- Ints Enabled
- Interrupt Seen light (optional)
- Int Seen
- Int Armed
- !STI! Arm | Ints Enabled
- This is also the interrupt acknowledge signal.
- Shared with IC36.
- Interrupts Enabled light (optional)
- !IRQ! should be driven by open-drain gates.
- It is pulled up here.
- Interrupt State Machine Waveforms
- !RESET | Reset (!RESET!)
- !STI | SEI Instruction (!STI! pulse)
- Notes | !WPC
- Interrupts Masked | !STI! Armed
- The Interrupt flag denotes our disposition to handle incoming interrupts (allow or ignore). | !CLI
- At !RESET! time, interrupts are cleared and further interrupts are masked (ignored). | PC loaded (!WPC! strobe)
- The falling edge of !CLI! or !RESET! clears the interrupt flag, ignoring interrupts. | !END | Interrupt signalled
- The falling edge of !STI! prepares to set the flag. The flag is actually set on the next !WPC! | (!IRQ!, ignored) | !CLI! or !RESET!
- Interrupts Enabled
- strobe, to make an STI-RTI pair atomic (and avoid other race conditions). | !IRQ
- 1 | 2 | 3 | 4 | 4 | 4 | 4 | 4
- When the interrupt flag is set, a low !IRQ! triggers an interrupt (FIRQ high). | End of µProgram (!END!) | Interrupt signalled (!IRQ!)
- STI-ARMED
- This is ignored until the end of the current instruction (rising edge of !END!).
- Interrupt µProgram | Interrupt armed
- At that point, the register FF clocks FIRQ in, asserting !IRQS! to the microcode sequencer.
- !STI-DELAY
- The K input of the flip flop is held constantly high. With FIRQ high, this is a toggle action.
- End of instruction (!END!)
- The Control Unit jumps to the Interrupt microprogram, which jumps to the Interrupt Service.
- FIRQ
- Routine. Before jumping, the interrupt microprogram asserts !CLI!, clearing FIRQ, so no further
- interrupts are seen. !IRQS! is thus deasserted, resuming normal execution.
- !FINT
- !IRQS
- Using !IRQS! as Interrupt Acknowledge
- Decoupling | !IRQ
- Interrupt Microprogram Running
- !IRQS
- Peripheral ssserts !IRQ, wait for !IRQS, then deasserts !IRQ.
- U

## Sheet 8 of 9
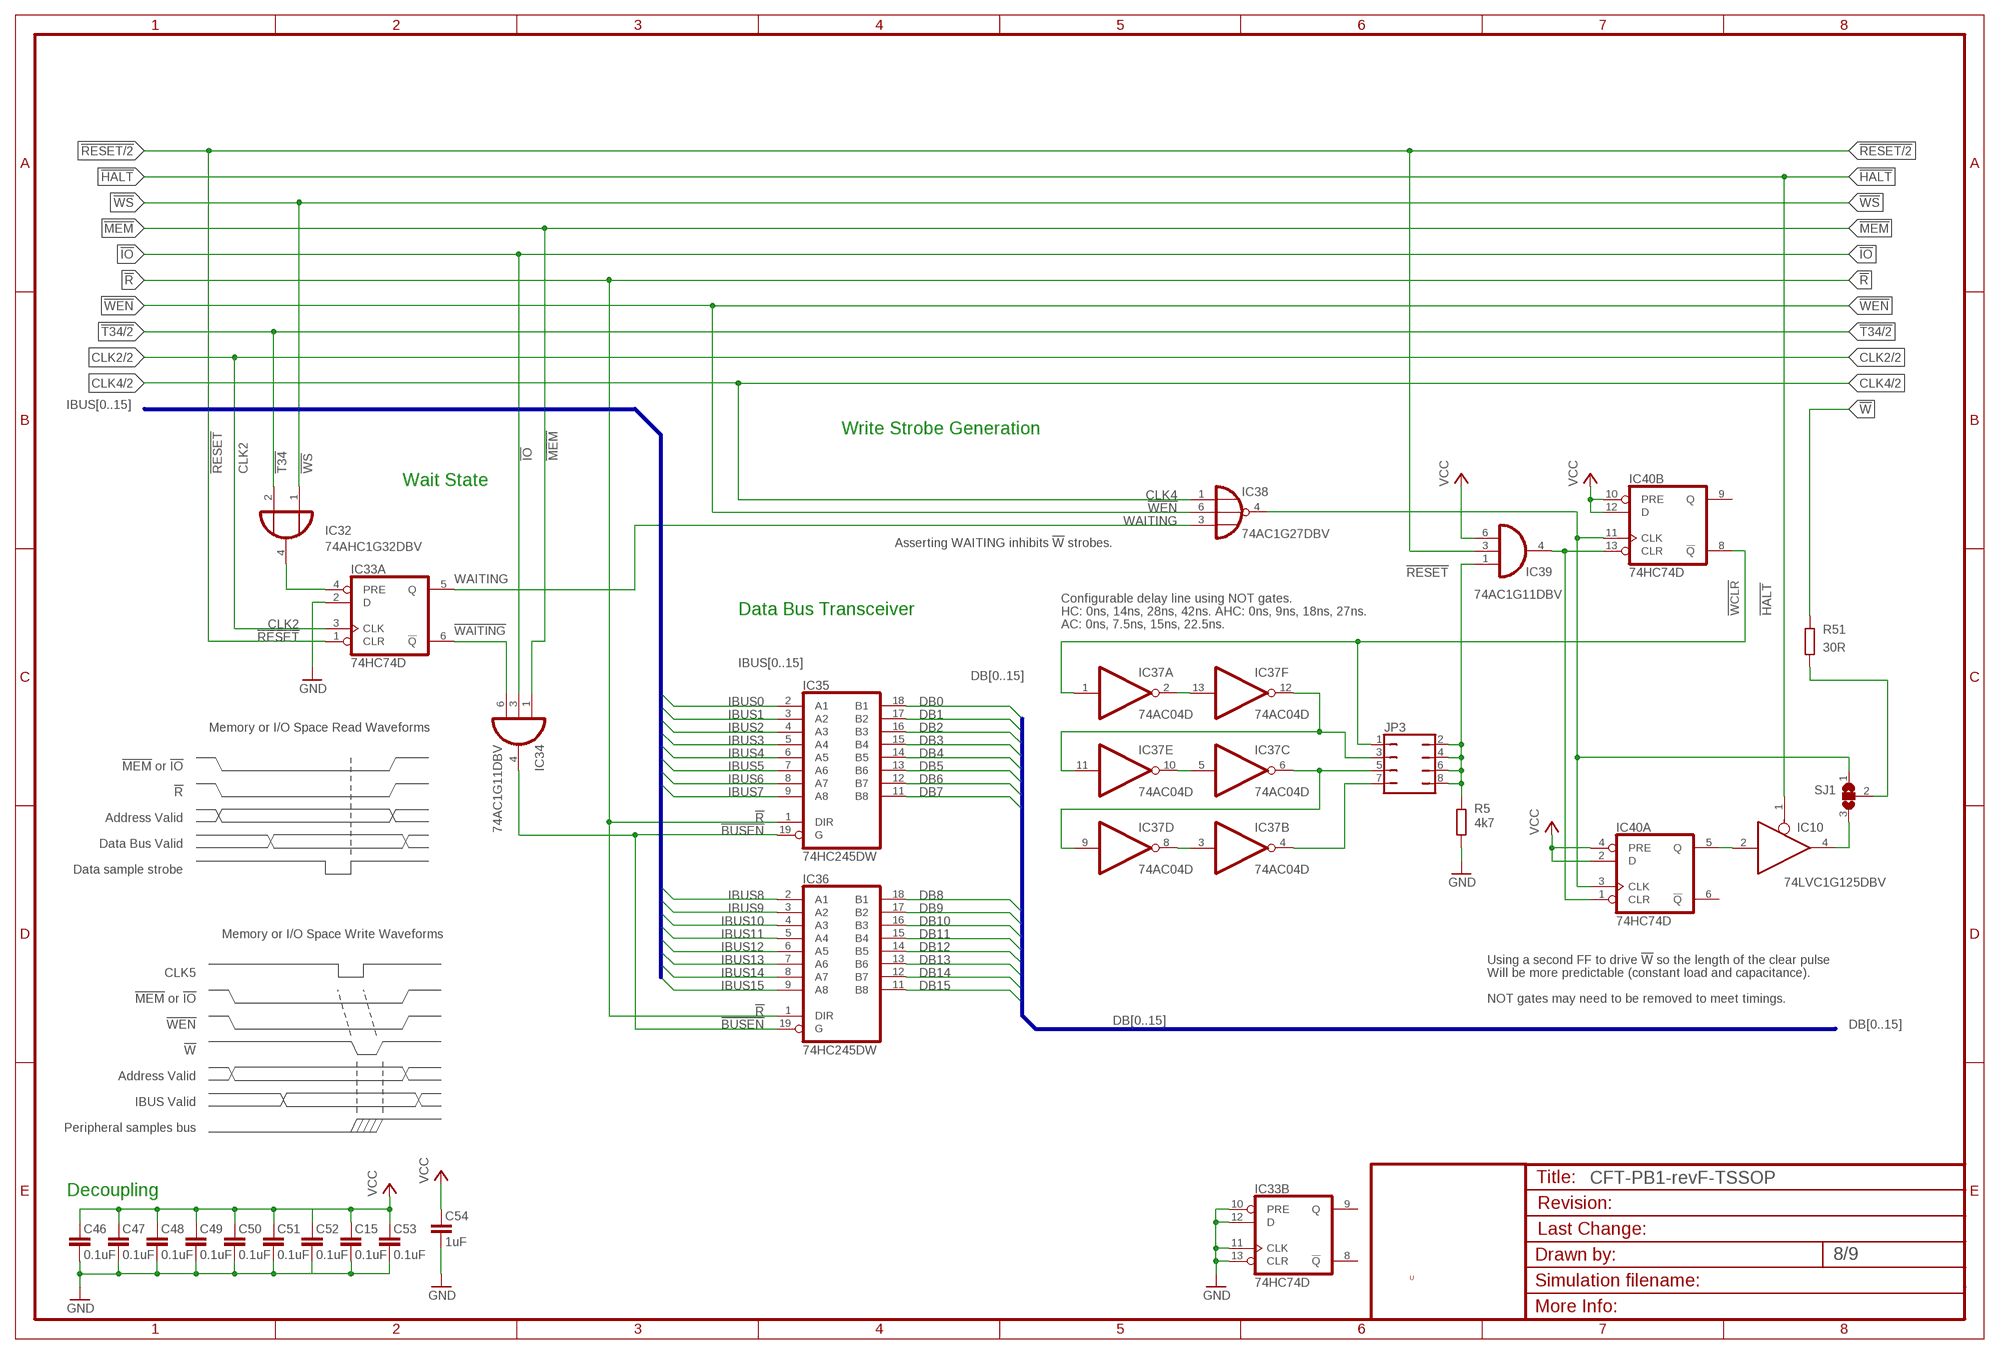
[diagram p7: schematic, sheet 8]

### Parts
C15  0.1uF  C-EUC0805K  [C0805K]
C46  0.1uF  C-EUC0805K  [C0805K]
C47  0.1uF  C-EUC0805K  [C0805K]
C48  0.1uF  C-EUC0805K  [C0805K]
C49  0.1uF  C-EUC0805K  [C0805K]
C50  0.1uF  C-EUC0805K  [C0805K]
C51  0.1uF  C-EUC0805K  [C0805K]
C52  0.1uF  C-EUC0805K  [C0805K]
C53  0.1uF  C-EUC0805K  [C0805K]
C54  1uF  C-EUC0805K  [C0805K]
IC10  74LVC1G125DBV  [SOT23-5]
IC32  74AHC1G32DBV  [SOT23-5]
IC33  74HC74D  [SO14]
IC34  74AC1G11DBV  [DBV_R-PDSO-G6]
IC35  74HC245DW  [SO20W]
IC36  74HC245DW  [SO20W]
IC37  74AC04D  [SO14]
IC38  74AC1G27DBV  [DBV_R-PDSO-G6]
IC39  74AC1G11DBV  [DBV_R-PDSO-G6]
IC40  74HC74D  [SO14]
JP3  JP4Q  [JP4Q]
R5  4k7  R-EU_R0805  [R0805]
R51  30R  R-EU_R0805  [R0805]
SJ1  SJ2W  [SJ_2]

### Nets
!BUSEN: IC34.4(O) IC35.19(G) IC36.19(G)
!HALT: IC10.1(OE) ; also sheet 9
!IO: IC34.3(I1) ; also sheet 9
!MEM: IC34.1(I0) ; also sheet 9
!R: IC35.1(DIR) IC36.1(DIR) ; also sheet 9
!RESET: IC33.1(A:CLR) IC39.3(I1) ; also sheet 2,3,4,7,9
!T34: IC32.2(I1) ; also sheet 2,9
!W: R51.1 ; also sheet 9
!WAITING: IC33.6(A:!Q) IC34.6(I2)
!WCLR: IC37.1(A:I) IC40.8(B:!Q) JP3.1
!WEN: IC38.6(I1) ; also sheet 9
!WS: IC32.1(I0) ; also sheet 9
CLK2: IC33.3(A:CLK) ; also sheet 2,9
CLK4: IC38.1(I0) ; also sheet 2,4,9
DB0: IC35.18(B1) ; also sheet 9
DB1: IC35.17(B2) ; also sheet 9
DB2: IC35.16(B3) ; also sheet 9
DB3: IC35.15(B4) ; also sheet 9
DB4: IC35.14(B5) ; also sheet 9
DB5: IC35.13(B6) ; also sheet 9
DB6: IC35.12(B7) ; also sheet 9
DB7: IC35.11(B8) ; also sheet 9
DB8: IC36.18(B1) ; also sheet 9
DB9: IC36.17(B2) ; also sheet 9
DB10: IC36.16(B3) ; also sheet 9
DB11: IC36.15(B4) ; also sheet 9
DB12: IC36.14(B5) ; also sheet 9
DB13: IC36.13(B6) ; also sheet 9
DB14: IC36.12(B7) ; also sheet 9
DB15: IC36.11(B8) ; also sheet 9
GND [Power rails]: C15.1 C46.1 C47.1 C48.1 C49.1 C50.1 C51.1 C52.1 C53.1 C54.1 IC33.2(A:D) IC33.10(B:PRE) IC33.11(B:CLK) IC33.12(B:D) IC33.13(B:CLR) R5.2 ; also sheet 2,3,4,5,6,7,9
IBUS0: IC35.2(A1) ; also sheet 3,5,6,9
IBUS1: IC35.3(A2) ; also sheet 3,5,6,9
IBUS2: IC35.4(A3) ; also sheet 3,5,6,9
IBUS3: IC35.5(A4) ; also sheet 3,5,6,9
IBUS4: IC35.6(A5) ; also sheet 3,5,6,9
IBUS5: IC35.7(A6) ; also sheet 3,5,6,9
IBUS6: IC35.8(A7) ; also sheet 3,5,6,9
IBUS7: IC35.9(A8) ; also sheet 3,5,6,9
IBUS8: IC36.2(A1) ; also sheet 3,5,6,9
IBUS9: IC36.3(A2) ; also sheet 3,5,6,9
IBUS10: IC36.4(A3) ; also sheet 3,5,6,9
IBUS11: IC36.5(A4) ; also sheet 3,5,6,9
IBUS12: IC36.6(A5) ; also sheet 3,5,6,9
IBUS13: IC36.7(A6) ; also sheet 3,5,6,9
IBUS14: IC36.8(A7) ; also sheet 3,5,6,9
IBUS15: IC36.9(A8) ; also sheet 3,5,6,9
N$1: IC38.4(O) IC40.3(A:CLK) IC40.11(B:CLK) SJ1.1
N$7: R51.2 SJ1.2
N$14: IC10.2(I) IC40.5(A:Q)
N$15: IC37.11(E:I) IC37.12(F:O) JP3.3
N$16: IC37.2(A:O) IC37.13(F:I)
N$17: IC37.5(C:I) IC37.10(E:O)
N$18: IC37.6(C:O) IC37.9(D:I) JP3.5
N$19: IC32.4(O) IC33.4(A:PRE)
N$20: IC37.3(B:I) IC37.8(D:O)
N$21: IC37.4(B:O) JP3.7
N$22: IC10.4(O) SJ1.3
N$24: IC39.1(I0) JP3.2 JP3.4 JP3.6 JP3.8 R5.1
N$25: IC39.4(O) IC40.1(A:CLR) IC40.13(B:CLR)
VCC [Power rails]: C15.2 C46.2 C47.2 C48.2 C49.2 C50.2 C51.2 C52.2 C53.2 C54.2 IC39.6(I2) IC40.2(A:D) IC40.4(A:PRE) IC40.10(B:PRE) IC40.12(B:D) ; also sheet 2,3,4,5,6,7,9
WAITING: IC33.5(A:Q) IC38.3(I2)
Unconnected: IC33.8(B:!Q) IC33.9(B:Q) IC40.6(A:!Q) IC40.9(B:Q)

### Buses
IBUS[0..15]
DB[0..15]

### Notes on the sheet
- Write Strobe Generation
- Wait State
- Asserting WAITING inhibits !W! strobes.
- Configurable delay line using NOT gates.
- Data Bus Transceiver | HC: 0ns, 14ns, 28ns, 42ns. AHC: 0ns, 9ns, 18ns, 27ns.
- AC: 0ns, 7.5ns, 15ns, 22.5ns.
- Memory or I/O Space Read Waveforms
- !MEM! or !IO
- !R
- Address Valid
- Data Bus Valid
- Data sample strobe
- Memory or I/O Space Write Waveforms
- Using a second FF to drive !W! so the length of the clear pulse
- CLK5 | Will be more predictable (constant load and capacitance).
- !MEM! or !IO | NOT gates may need to be removed to meet timings.
- !WEN
- !W
- Address Valid
- IBUS Valid
- Peripheral samples bus
- Decoupling
- U

## Sheet 9 of 9
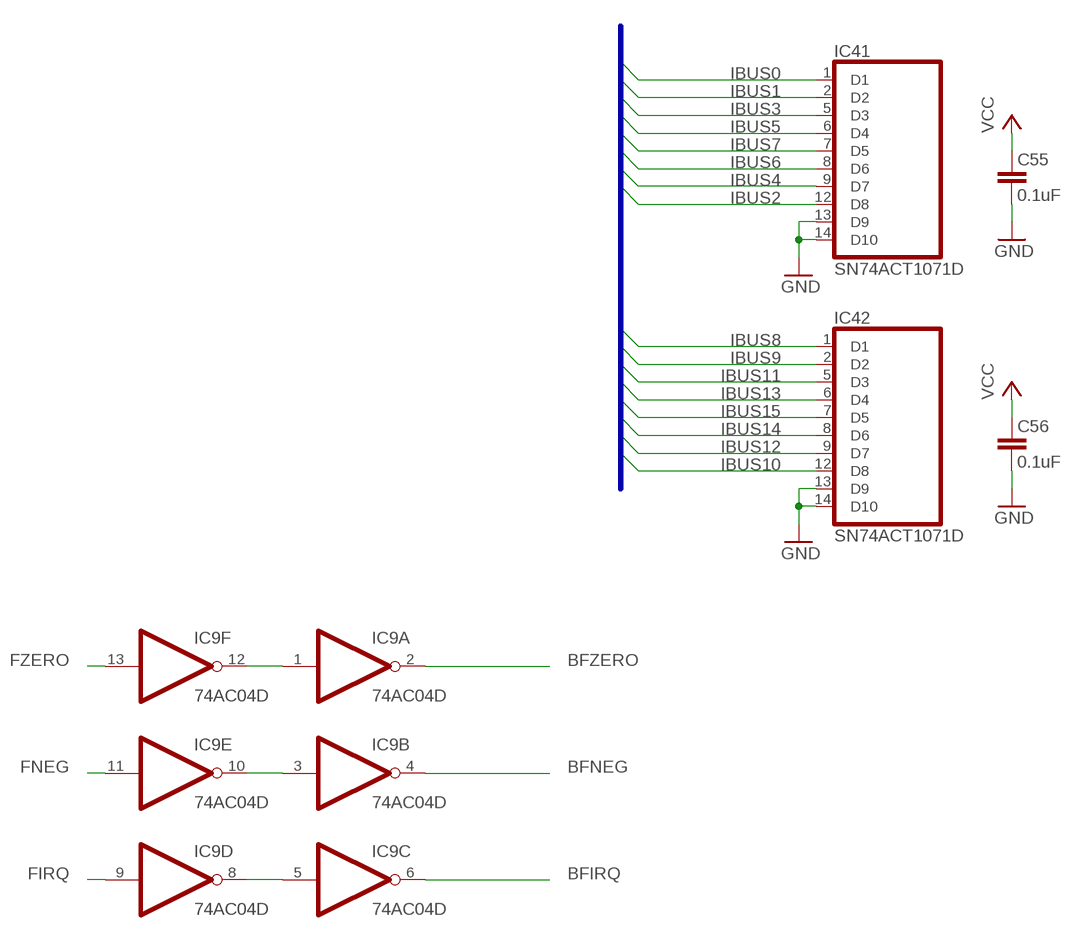
[diagram p8: schematic, sheet 9, part 1 of 2]
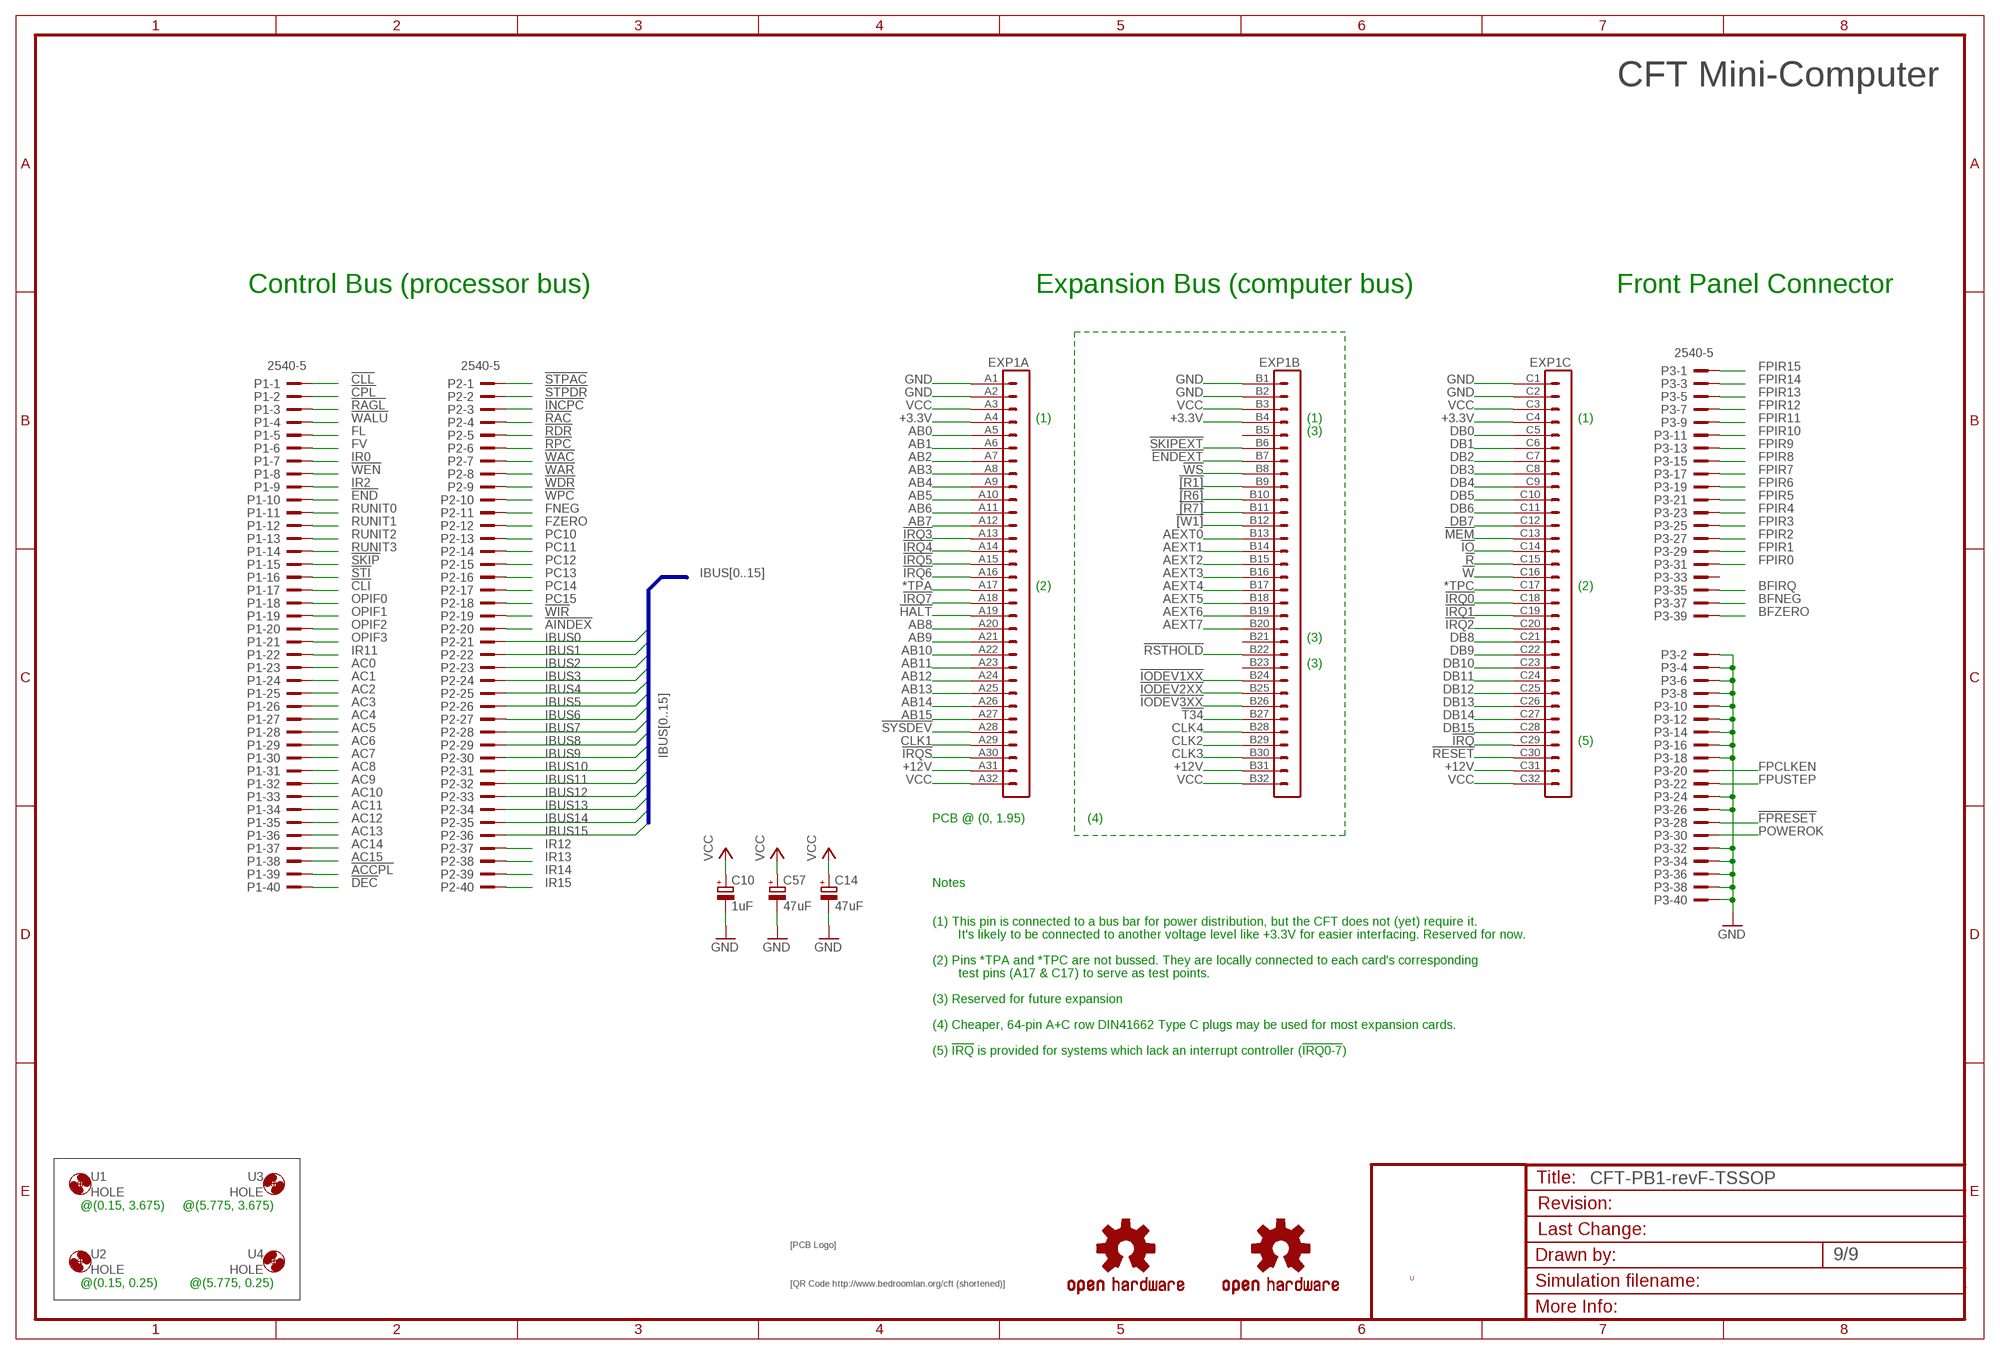
[diagram p9: schematic, sheet 9, part 2 of 2]

### Parts
$4_37_$1  SIGNATURESILK  [SIGNATURE]
$4_39_$  OSHW-LOGOL  [OSHW-LOGO-L]
$4_39_$1  OSHW-LOGOL  [OSHW-LOGO-L]
$4_40_$  QRCODE-CFT  [CFT-QRCODE]
C10  1uF  CPOL-EUE2.5-5  [E2,5-5]
C14  47uF  CPOL-EUE2.5-5  [E2,5-5]
C55  0.1uF  C-EUC0805K  [C0805K]
C56  0.1uF  C-EUC0805K  [C0805K]
C57  47uF  CPOL-EUE2.5-5  [E2,5-5]
EXP1  VG96-3K  [VG96K]
IC9  74AC04D  [SO14]
IC41  SN74ACT1071D  [SO14]
IC42  SN74ACT1071D  [SO14]
P1  2540-5  [PAK100/2500-5-40]
P2  2540-5  [PAK100/2500-5-40]
P3  2540-5  [PAK100/2500-5-40]
U1  HOLE  [STANDOFF_28_60]
U2  HOLE  [STANDOFF_28_60]
U3  HOLE  [STANDOFF_28_60]
U4  HOLE  [STANDOFF_28_60]

### Nets
![R1]: EXP1.B9
![R6]: EXP1.B10
![R7]: EXP1.B11
![W1]: EXP1.B12
!ACCPL: P1.39
!AINDEX: P2.20
!CLI: P1.17 ; also sheet 7
!CLL: P1.1
!CPL: P1.2
!DEC: P1.40
!END: P1.10 ; also sheet 5,7
!ENDEXT: EXP1.B7
!FPRESET: P3.28 ; also sheet 3
!HALT: EXP1.A19 ; also sheet 8
!INCPC: P2.3
!IO: EXP1.C14 ; also sheet 8
!IODEV1XX: EXP1.B24
!IODEV2XX: EXP1.B25
!IODEV3XX: EXP1.B26
!IRQ: EXP1.C29 ; also sheet 7
!IRQ0: EXP1.C18
!IRQ1: EXP1.C19
!IRQ2: EXP1.C20
!IRQ3: EXP1.A13
!IRQ4: EXP1.A14
!IRQ5: EXP1.A15
!IRQ6: EXP1.A16
!IRQ7: EXP1.A18
!IRQS: EXP1.A30 ; also sheet 7
!MEM: EXP1.C13 ; also sheet 8
!R: EXP1.C15 ; also sheet 8
!RAC: P2.4
!RAGL: P1.3 ; also sheet 5
!RDR: P2.5
!RESET: EXP1.C30 ; also sheet 2,3,4,7,8
!RPC: P2.6
!RSTHOLD: EXP1.B22 ; also sheet 3
!SKIP: P1.15 ; also sheet 4
!SKIPEXT: EXP1.B6 ; also sheet 4
!STI: P1.16 ; also sheet 7
!STPAC: P2.1
!STPDR: P2.2
!SYSDEV: EXP1.A28
!T34: EXP1.B27 ; also sheet 2,8
!W: EXP1.C16 ; also sheet 8
!WAC: P2.7
!WALU: P1.4
!WAR: P2.8
!WDR: P2.9
!WEN: P1.8 ; also sheet 8
!WIR: P2.19 ; also sheet 6
!WPC: P2.10 ; also sheet 7
!WS: EXP1.B8 ; also sheet 8
*TPA: EXP1.A17
*TPC: EXP1.C17
+3.3V: EXP1.A4 EXP1.B4 EXP1.C4
+12V [Power rails]: EXP1.A31 EXP1.B31 EXP1.C31
AB0: EXP1.A5
AB1: EXP1.A6
AB2: EXP1.A7
AB3: EXP1.A8
AB4: EXP1.A9
AB5: EXP1.A10
AB6: EXP1.A11
AB7: EXP1.A12
AB8: EXP1.A20
AB9: EXP1.A21
AB10: EXP1.A22
AB11: EXP1.A23
AB12: EXP1.A24
AB13: EXP1.A25
AB14: EXP1.A26
AB15: EXP1.A27
AC0: P1.23
AC1: P1.24
AC2: P1.25
AC3: P1.26
AC4: P1.27
AC5: P1.28
AC6: P1.29
AC7: P1.30
AC8: P1.31
AC9: P1.32
AC10: P1.33
AC11: P1.34
AC12: P1.35
AC13: P1.36
AC14: P1.37
AC15: P1.38
AEXT0: EXP1.B13
AEXT1: EXP1.B14
AEXT2: EXP1.B15
AEXT3: EXP1.B16
AEXT4: EXP1.B17
AEXT5: EXP1.B18
AEXT6: EXP1.B19
AEXT7: EXP1.B20
BFIRQ: IC9.6(C:O) P3.35
BFNEG: IC9.4(B:O) P3.37
BFZERO: IC9.2(A:O) P3.39
CLK1: EXP1.A29 ; also sheet 2
CLK2: EXP1.B29 ; also sheet 2,8
CLK3: EXP1.B30 ; also sheet 2,3
CLK4: EXP1.B28 ; also sheet 2,4,8
DB0: EXP1.C5 ; also sheet 8
DB1: EXP1.C6 ; also sheet 8
DB2: EXP1.C7 ; also sheet 8
DB3: EXP1.C8 ; also sheet 8
DB4: EXP1.C9 ; also sheet 8
DB5: EXP1.C10 ; also sheet 8
DB6: EXP1.C11 ; also sheet 8
DB7: EXP1.C12 ; also sheet 8
DB8: EXP1.C21 ; also sheet 8
DB9: EXP1.C22 ; also sheet 8
DB10: EXP1.C23 ; also sheet 8
DB11: EXP1.C24 ; also sheet 8
DB12: EXP1.C25 ; also sheet 8
DB13: EXP1.C26 ; also sheet 8
DB14: EXP1.C27 ; also sheet 8
DB15: EXP1.C28 ; also sheet 8
FIRQ: IC9.9(D:I) ; also sheet 7
FL: P1.5 ; also sheet 4
FNEG: IC9.11(E:I) P2.11 ; also sheet 4
FPCLKEN: P3.20 ; also sheet 2
FPIR0: P3.31 ; also sheet 6
FPIR1: P3.29 ; also sheet 6
FPIR2: P3.27 ; also sheet 6
FPIR3: P3.25 ; also sheet 6
FPIR4: P3.23 ; also sheet 6
FPIR5: P3.21 ; also sheet 6
FPIR6: P3.19 ; also sheet 6
FPIR7: P3.17 ; also sheet 6
FPIR8: P3.15 ; also sheet 6
FPIR9: P3.13 ; also sheet 6
FPIR10: P3.11 ; also sheet 6
FPIR11: P3.9 ; also sheet 6
FPIR12: P3.7 ; also sheet 6
FPIR13: P3.5 ; also sheet 6
FPIR14: P3.3 ; also sheet 6
FPIR15: P3.1 ; also sheet 6
FPUSTEP: P3.22 ; also sheet 2
FV: P1.6 ; also sheet 4
FZERO: IC9.13(F:I) P2.12 ; also sheet 4
GND [Power rails]: C10.- C14.- C55.1 C56.1 C57.- EXP1.A1 EXP1.A2 EXP1.B1 EXP1.B2 EXP1.C1 EXP1.C2 IC41.13(D9) IC41.14(D10) IC42.13(D9) IC42.14(D10) P3.2 P3.4 P3.6 P3.8 P3.10 P3.12 P3.14 P3.16 P3.18 P3.24 P3.26 P3.32 P3.34 P3.36 P3.38 P3.40 ; also sheet 2,3,4,5,6,7,8
IBUS0: IC41.1(D1) P2.21 ; also sheet 3,5,6,8
IBUS1: IC41.2(D2) P2.22 ; also sheet 3,5,6,8
IBUS2: IC41.12(D8) P2.23 ; also sheet 3,5,6,8
IBUS3: IC41.5(D3) P2.24 ; also sheet 3,5,6,8
IBUS4: IC41.9(D7) P2.25 ; also sheet 3,5,6,8
IBUS5: IC41.6(D4) P2.26 ; also sheet 3,5,6,8
IBUS6: IC41.8(D6) P2.27 ; also sheet 3,5,6,8
IBUS7: IC41.7(D5) P2.28 ; also sheet 3,5,6,8
IBUS8: IC42.1(D1) P2.29 ; also sheet 3,5,6,8
IBUS9: IC42.2(D2) P2.30 ; also sheet 3,5,6,8
IBUS10: IC42.12(D8) P2.31 ; also sheet 3,5,6,8
IBUS11: IC42.5(D3) P2.32 ; also sheet 3,5,6,8
IBUS12: IC42.9(D7) P2.33 ; also sheet 3,5,6,8
IBUS13: IC42.6(D4) P2.34 ; also sheet 3,5,6,8
IBUS14: IC42.8(D6) P2.35 ; also sheet 3,5,6,8
IBUS15: IC42.7(D5) P2.36 ; also sheet 3,5,6,8
IR0: P1.7 ; also sheet 4,5,6
IR2: P1.9 ; also sheet 4,5,6
IR11: P1.22 ; also sheet 6
IR12: P2.37 ; also sheet 6
IR13: P2.38 ; also sheet 6
IR14: P2.39 ; also sheet 6
IR15: P2.40 ; also sheet 6
N$3: IC9.1(A:I) IC9.12(F:O)
N$4: IC9.3(B:I) IC9.10(E:O)
N$6: IC9.5(C:I) IC9.8(D:O)
OPIF0: P1.18 ; also sheet 4
OPIF1: P1.19 ; also sheet 4
OPIF2: P1.20 ; also sheet 4
OPIF3: P1.21 ; also sheet 4
PC10: P2.13 ; also sheet 5
PC11: P2.14 ; also sheet 5
PC12: P2.15 ; also sheet 5
PC13: P2.16 ; also sheet 5
PC14: P2.17 ; also sheet 5
PC15: P2.18 ; also sheet 5
POWEROK: P3.30 ; also sheet 3
RUNIT0: P1.11
RUNIT1: P1.12
RUNIT2: P1.13
RUNIT3: P1.14
VCC [Power rails]: C10.+ C14.+ C55.2 C56.2 C57.+ EXP1.A3 EXP1.A32 EXP1.B3 EXP1.B32 EXP1.C3 EXP1.C32 ; also sheet 2,3,4,5,6,7,8
Unconnected: EXP1.B5 EXP1.B21 EXP1.B23 P3.33

### Buses
IBUS[0..15]

### Notes on the sheet
- CFT Mini-Computer
- Control Bus (processor bus) | Expansion Bus (computer bus) | Front Panel Connector
- (1) | (1) | (1)
- (3)
- (2) | (2)
- (3)
- (3)
- (5)
- PCB @ (0, 1.95) | (4)
- Notes
- (1) This pin is connected to a bus bar for power distribution, but the CFT does not (yet) require it.
- It's likely to be connected to another voltage level like +3.3V for easier interfacing. Reserved for now.
- (2) Pins *TPA and *TPC are not bussed. They are locally connected to each card's corresponding
- test pins (A17 & C17) to serve as test points.
- (3) Reserved for future expansion
- (4) Cheaper, 64-pin A+C row DIN41662 Type C plugs may be used for most expansion cards.
- (5) !IRQ! is provided for systems which lack an interrupt controller (!IRQ0-7!)
- @(0.15, 3.675) | @(5.775, 3.675)
- U
- @(0.15, 0.25) | @(5.775, 0.25)

## Power pins joined to a net without a drawn wire
GND: IC1.8(GND) IC2.8(GND) IC3.8(P:GND) IC4.3(GND) IC5.8(GND) IC6.10(GND) IC7.10(GND) IC8.10(GND) IC9.7(P:GND) IC10.3(GND) IC11.3(GND) IC12.7(P:GND) IC13.7(P:GND) IC14.7(P:GND) IC15.3(GND) IC16.7(P:GND) IC17.3(GND) IC18.8(GND) IC19.8(GND) IC20.2(GND) IC21.7(P:GND) IC22.10(GND) IC23.10(GND) IC24.10(GND) IC25.10(GND) IC26.10(GND) IC27.10(GND) IC29.3(GND) IC30.3(GND) IC31.8(P:GND) IC32.3(GND) IC33.7(P:GND) IC34.2(GND) IC35.10(GND) IC36.10(GND) IC37.7(P:GND) IC38.2(GND) IC39.2(GND) IC40.7(P:GND) IC41.3(GND) IC41.4(GND) IC42.3(GND) IC42.4(GND)
VCC: IC1.16(VCC) IC2.16(VCC) IC3.16(P:VCC) IC4.5(VCC) IC5.16(VCC) IC6.20(VCC) IC7.20(VCC) IC8.20(VCC) IC9.14(P:VCC) IC10.5(VCC) IC11.5(VCC) IC12.14(P:VCC) IC13.14(P:VCC) IC14.14(P:VCC) IC15.5(VCC) IC16.14(P:VCC) IC17.5(VCC) IC18.16(VCC) IC19.16(VCC) IC20.5(VCC) IC21.14(P:VCC) IC22.20(VCC) IC23.20(VCC) IC24.20(VCC) IC25.20(VCC) IC26.20(VCC) IC27.20(VCC) IC29.5(VCC) IC30.5(VCC) IC31.16(P:VCC) IC32.5(VCC) IC33.14(P:VCC) IC34.5(VCC) IC35.20(VCC) IC36.20(VCC) IC37.14(P:VCC) IC38.5(VCC) IC39.5(VCC) IC40.14(P:VCC) IC41.10(VCC) IC41.11(VCC) IC42.10(VCC) IC42.11(VCC)

## Library data of the parts
$4_37_$1 = alexios:SIGNATURE: Soup signature
$4_39_$ $4_39_$1 = SparkFun:OSHW-LOGO: Open Source Hardware Logo This logo indicates the piece of hardware it is found on incorporates a OSHW license and/or adheres to the definition of open source hardware found here: http://freedomdefined.org/OSHW
$4_40_$ = alexios:QRCODE-*: Various QR codes in silkscreen.
C1-C9 C11-C13 C15 C16 C21-C40 C44-C56 = rcl:C-EU: CAPACITOR, European symbol
C10 C14 C57 = rcl:CPOL-EU: POLARIZED CAPACITOR, European symbol
D1-D3 = alexios:DIODE-: DIODE
EXP1 = alexios-19inch:VG96-3: PCB EUROCARD, 96-pin type C/ABC, 2.54 mm
IC1 = alexios:74*253: Dual 4-to 1 line data SELECTOR/MULTIPLEXER, 3-state
IC2 = alexios:74*193: Presettable Synchronous Binary Up/Down Counter Up/down 4-bit binary counter with load and clear inputs, and borrow and carry outputs. Farnell description: <http://uk.farnell.com/nxp/74hct193n/ic-74hct-cmos-74hct193-dip16-5v/dp/382218> Order Code: 382218 Manufacturer Part No: 74HCT193N RoHS : Yes Description: IC, 74HCT CMOS, 74HCT193, DIP16, 5V Counter Type:Binary Clock Frequency:47MHz Count Maximum:15 Supply Voltage Range:4.5V to 5.5V Logic Case Style:DIP No. of Pins:16 Operating Temperature Range:-40°C to +125°C Base Number:74 Clock Frequency Max:43MHz Count Max:16 Counter Measuring Functions:Presettable Synchronous Binary Up / Down Counter Device Marking:74HCT193 IC Generic Number:74HCT193 Logic Function Number:193 Logic IC Base Number:74193 Logic IC Family:HCT Logic IC Function:Presettable Synchronous 4bit Binary Up/Down Counter No. of Gates:1 No. of Inputs:4 Operating Temperature Max:125°C Operating Temperature Min:-40°C Package / Case:DIP Supply Voltage:5V Supply Voltage Max:5.5V Supply Voltage Min:4.5V Termination Type:Through Hole
IC3 = alexios:74*139: Dual 2-line to 4-line DECODER/DEMULTIPLEXER
IC4 = alexios:74*1G17: Single Schmitt-Trigger Buffer
IC5 = alexios:74*590: 8-bit binary COUNTER, output register
IC6-IC8 IC23 IC24 IC27 = alexios:74*541: Octal BUFFER and LINE DRIVER, 3-state
IC9 IC37 = alexios:74*04: Hex INVERTER
IC10 = 74xx-little-us:74*1G125: Single Bus Buffer Gate with 3-State Output
IC11 IC17 = alexios:74*1G04: INVERTER Gate
IC12 IC21 IC33 IC40 = alexios:74*74: Dual D type positive edge triggered FLIP FLOP, preset and clear
IC13 = alexios:74*08: Quad 2-input AND gate
IC14 IC16 = alexios:74*32: Quad 2-input OR gate
IC15 = alexios:74*1G86: 2-input EXCLUSIV-OR gate
IC18 IC19 = alexios:74*251: 1 of 8 data SELECTOR/MULTIPLEXER, 3-state
IC20 IC34 IC39 = alexios:74*1G11: Single 3-input AND gate Datasheet <http://www.ti.com/lit/ds/symlink/sn74lvc1g11.pdf>.
IC22 = alexios:74*574: 8-bit D type FLIP FLOP bus driver
IC25 IC26 = alexios:74*573: 8-bit D latch BUS DRIVER
IC29 = alexios:74*1G08: 2-input AND gate
IC30 IC32 = alexios:74*1G32: 2-input OR gate
IC31 = alexios:74*112: Dual J-K negative edge triggered FLIP FLOP, preset and clear
IC35 IC36 = alexios:74*245: Octal BUS TRANSCEIVER, 3-state
IC38 = alexios:74*1G27: Single 3-input NOR gate Datasheet <http://www.ti.com/lit/ds/symlink/sn74lvc1g27.pdf>
IC41 IC42 = alexios:SN74ACT1071: 10-BIT BUS-TERMINATION ARRAY WITH BUS-HOLD FUNCTION Datasheet: http://www.ti.com/lit/ds/scas192/scas192.pdf
JP1 = pinhead:PINHD-1X2: PIN HEADER
JP2 = jumper:JP5Q: JUMPER
JP3 = jumper:JP4Q: JUMPER
LED1-LED4 = alexios:LED: LED OSRAM: - CHIPLED LG R971, LG N971, LY N971, LG Q971, LY Q971, LO R971, LY R971 LH N974, LH R974 LS Q976, LO Q976, LY Q976 LO Q996 - Hyper CHIPLED LW Q18S LB Q993, LB Q99A, LB R99A - SideLED LS A670, LO A670, LY A670, LG A670, LP A670 LB A673, LV A673, LT A673, LW A673 LH A674 LY A675 LS A676, LA A676, LO A676, LY A676, LW A676 LS A679, LY A679, LG A679 - Hyper Micro SIDELED® LS Y876, LA Y876, LO Y876, LY Y876 LT Y87S - SmartLED LW L88C, LW L88S LB L89C, LB L89S, LG L890 LS L89K, LO L89K, LY L89K LS L896, LA L896, LO L896, LY L896 - TOPLED LS T670, LO T670, LY T670, LG T670, LP T670 LSG T670, LSP T670, LSY T670, LOP T670, LYG T670 LG T671, LOG T671, LSG T671 LB T673, LV T673, LT T673, LW T673 LH T674 LS T676, LA T676, LO T676, LY T676, LB T676, LH T676, LSB T676, LW T676 LB T67C, LV T67C, LT T67C, LS T67K, LO T67K, LY T67K, LW E67C LS E67B, LA E67B, LO E67B, LY E67B, LB E67C, LV E67C, LT E67C LW T67C LS T679, LY T679, LG T679 LS T770, LO T770, LY T770, LG T770, LP T770 LB T773, LV T773, LT T773, LW T773 LH T774 LS E675, LA E675, LY E675, LS T675 LS T776, LA T776, LO T776, LY T776, LB T776 LHGB T686 LT T68C, LB T68C - Hyper Mini TOPLED® LB M676 - Mini TOPLED Santana® LG M470 LS M47K, LO M47K, LY M47K Source: http://www.osram.convergy.de LUXEON: - LUMILED® LXK2-PW12-R00, LXK2-PW12-S00, LXK2-PW14-U00, LXK2-PW14-V00 LXK2-PM12-R00, LXK2-PM12-S00, LXK2-PM14-U00 LXK2-PE12-Q00, LXK2-PE12-R00, LXK2-PE12-S00, LXK2-PE14-T00, LXK2-PE14-U00 LXK2-PB12-K00, LXK2-PB12-L00, LXK2-PB12-M00, LXK2-PB14-N00, LXK2-PB14-P00, LXK2-PB14-Q00 LXK2-PR12-L00, LXK2-PR12-M00, LXK2-PR14-Q00, LXK2-PR14-R00 LXK2-PD12-Q00, LXK2-PD12-R00, LXK2-PD12-S00 LXK2-PH12-R00, LXK2-PH12-S00 LXK2-PL12-P00, LXK2-PL12-Q00, LXK2-PL12-R00 Source: www.luxeon.com KINGBRIGHT: KA-3528ASYC Source: www.kingbright.com
P1-P3 = con-3m:2540-: 3M (TM) Pak 100 4-Wall Header Source: 3M; OC_FARNELL: 9838414; OC_NEWARK: unknown
R1-R5 R9-R11 R13-R16 R41 R48-R51 = resistor:R-EU_: RESISTOR, European symbol
R6 R7 R40 = rcl:R-EU_: RESISTOR, European symbol
RN1 RN19 = resistor-net:CTS742C083: Chip Resistor Array 4 Single Resistor Source: http://www.ctscorp.com/components/Datasheets/CTSChipArrayDs.pdf; OC_FARNELL: unknown; OC_NEWARK: unknown
S1 = SparkFun:TAC_SWITCH: Momentary Switch Button commonly used for reset or general input. Spark Fun Electronics SKU : COM-00097
SJ1 = jumper:SJ2W: SMD solder JUMPER
T1 T2 = transistor:BC848: NPN TRANSISTOR
U1-U4 = alexios:HOLE: Hole for a standoff or mount. Hole diameter: 3.3mm. External Diameter: 6mm. Suitable for M3 standoffs.
XTAL1 = alexios:XO-: Crystal Oscillator for DIP sockets Crystal oscillators in DIP8 or DIP14 packages with sockets. Drills extra holes on the PCB to allow a standard DIP8 or DIP14 socket to be installed.

## Net classes
0 default: width 0.254 mm, clearance 0.152 mm
1 low power: width 0.254 mm, clearance 0.152 mm
2 Power rails: width 0.61 mm, clearance 0.152 mm